# EAGLE design tarjeta-v10 (EAGLE 6.4)
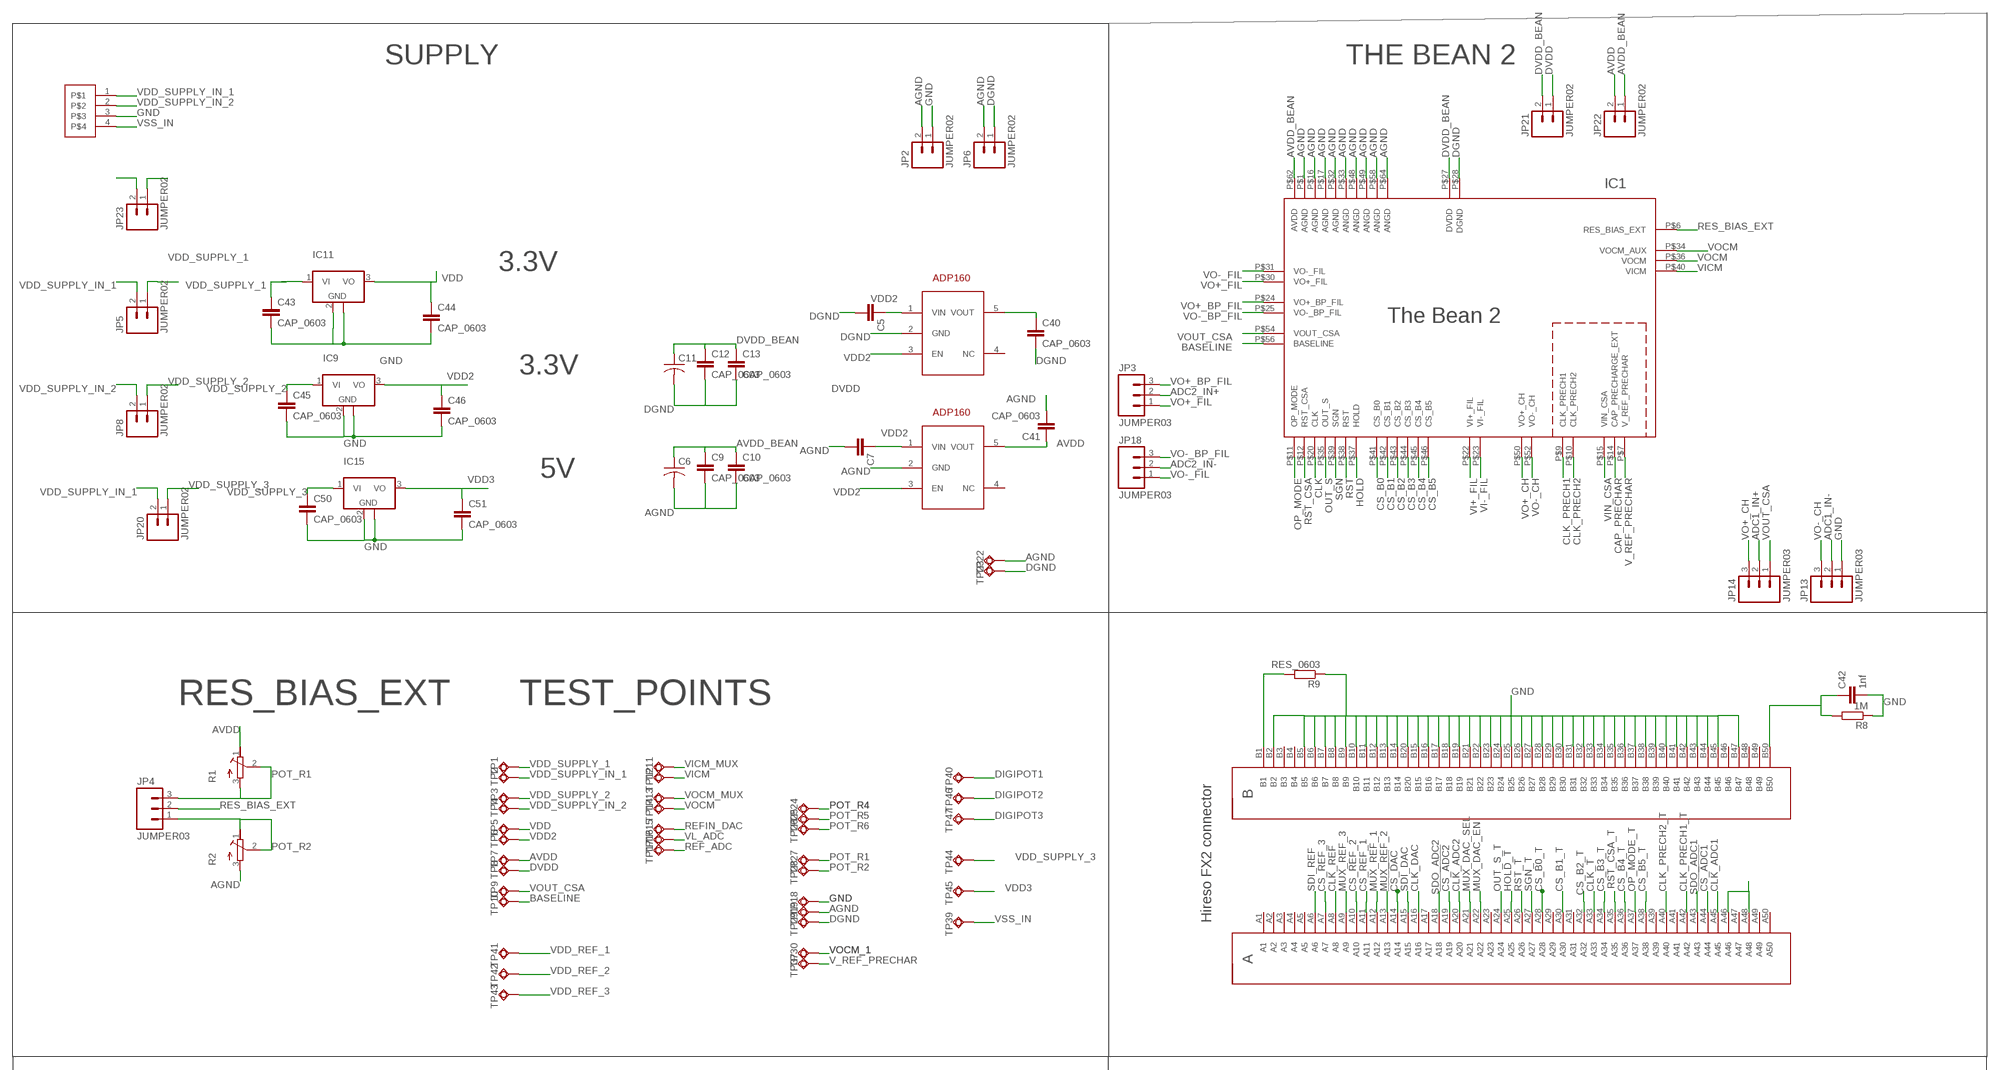
[diagram p0: schematic, sheet 1, part 1 of 3]
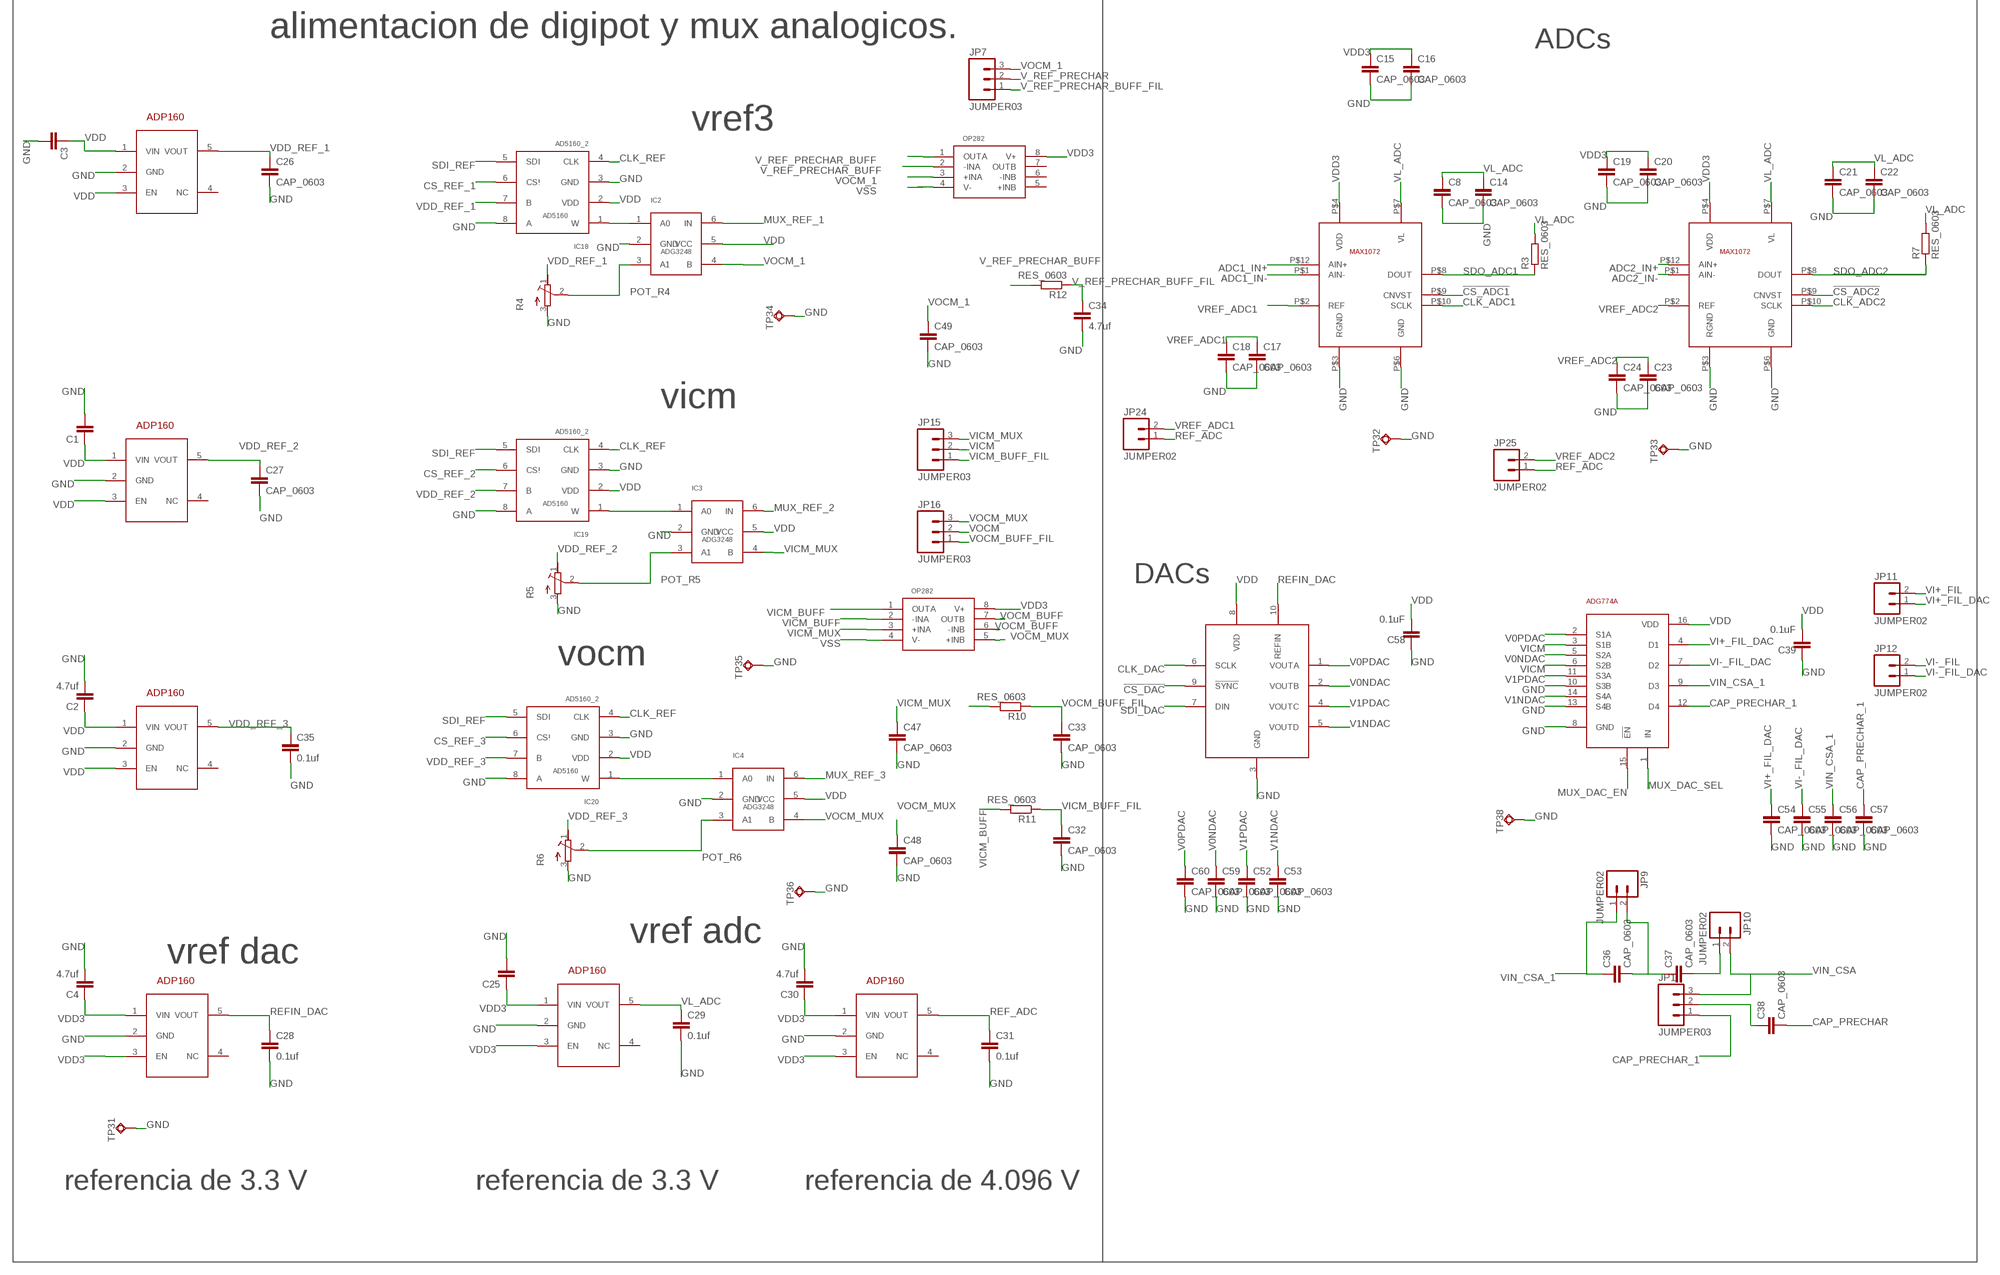
[diagram p1: schematic, sheet 1, part 2 of 3]
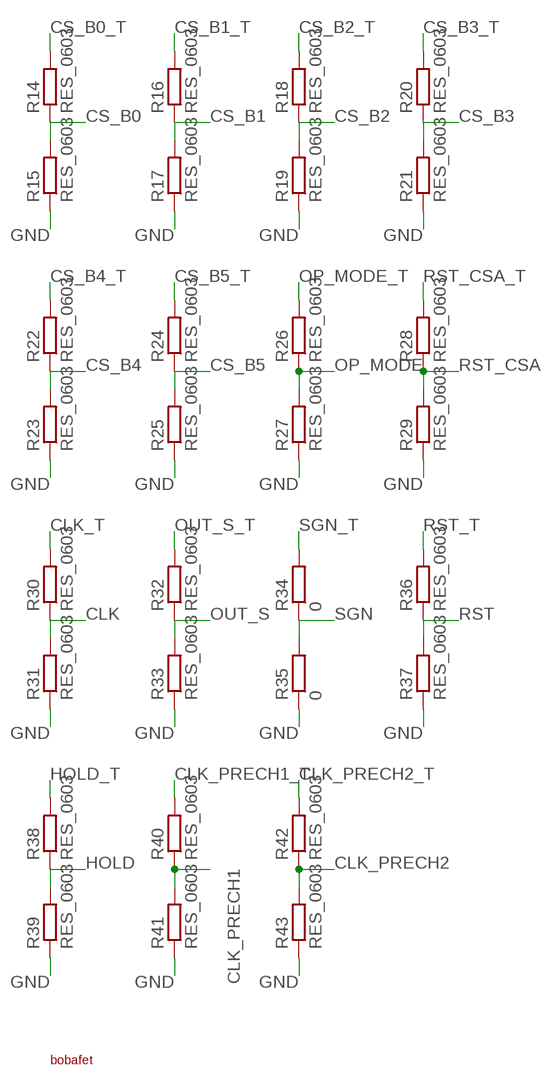
[diagram p2: schematic, sheet 1, part 3 of 3]

## Parts
C1  CAP_0402  [C0402]
C2  4.7uf  CAP_0402  [C0402]
C3  CAP_0402  [C0402]
C4  4.7uf  CAP_0402  [C0402]
C5  CAP_0402  [C0402]
C6  CAP_0805  [C0805]
C7  CAP_0402  [C0402]
C8  CAP_0603  [C0603]
C9  CAP_0603  [C0603]
C10  CAP_0603  [C0603]
C11  CAP_0805  [C0805]
C12  CAP_0603  [C0603]
C13  CAP_0603  [C0603]
C14  CAP_0603  [C0603]
C15  CAP_0603  [C0603]
C16  CAP_0603  [C0603]
C17  CAP_0603  [C0603]
C18  CAP_0603  [C0603]
C19  CAP_0603  [C0603]
C20  CAP_0603  [C0603]
C21  CAP_0603  [C0603]
C22  CAP_0603  [C0603]
C23  CAP_0603  [C0603]
C24  CAP_0603  [C0603]
C25  CAP_0402  [C0402]
C26  CAP_0603  [C0603]
C27  CAP_0603  [C0603]
C28  0.1uf  CAP_0603  [C0603]
C29  0.1uf  CAP_0603  [C0603]
C30  4.7uf  CAP_0402  [C0402]
C31  0.1uf  CAP_0603  [C0603]
C32  CAP_0603  [C0603]
C33  CAP_0603  [C0603]
C34  4.7uf  CAP_0603  [C0603]
C35  0.1uf  CAP_0603  [C0603]
C36  CAP_0603  [C0603]
C37  CAP_0603  [C0603]
C38  CAP_0603  [C0603]
C39  0.1uF  CAP_0603  [C0603]
C40  CAP_0603  [C0603]
C41  CAP_0603  [C0603]
C42  1nf  CAP_0603  [C0603]
C43  CAP_0603  [C0603]
C44  CAP_0603  [C0603]
C45  CAP_0603  [C0603]
C46  CAP_0603  [C0603]
C47  CAP_0603  [C0603]
C48  CAP_0603  [C0603]
C49  CAP_0603  [C0603]
C50  CAP_0603  [C0603]
C51  CAP_0603  [C0603]
C52  CAP_0603  [C0603]
C53  CAP_0603  [C0603]
C54  CAP_0603  [C0603]
C55  CAP_0603  [C0603]
C56  CAP_0603  [C0603]
C57  CAP_0603  [C0603]
C58  0.1uF  CAP_0603  [C0603]
C59  CAP_0603  [C0603]
C60  CAP_0603  [C0603]
IC1  THEBEAN2  [CQFP64]
IC2  ADG3248  [SC70]
IC3  ADG3248  [SC70]
IC4  ADG3248  [SC70]
IC5  ADP160  [SOT23-5L_2]
IC6  ADP160  [SOT23-5L_2]
IC7  ADP160  [SOT23-5L_2]
IC8  ADP160  [SOT23-5L_2]
IC9  UA78M  [SOT223]
IC10  ADP160  [SOT23-5L_2]
IC11  UA78M  [SOT223]
IC12  OP282  [SOIC8]
IC13  ADP160  [SOT23-5L_2]
IC14  OP282  [SOIC8]
IC15  UA78M  [SOT223]
IC16  ADP160  [SOT23-5L_2]
IC17  ADP160  [SOT23-5L_2]
IC18  AD5160_2  [SOT23-8_2]
IC19  AD5160_2  [SOT23-8_2]
IC20  AD5160_2  [SOT23-8_2]
IC21  ADG774A  [QSOP16]
IC22  MAX1072  [TQFN12]
IC23  DAC7554  [MSOP10]
IC24  MAX1072  [TQFN12]
J1  HIRESO_FX_CONNECTOR  [FX2-100S-1.27]
JP1  JUMPER03  [1X03]
JP2  JUMPER02  [1X02]
JP3  JUMPER03  [1X03]
JP4  JUMPER03  [1X03]
JP5  JUMPER02  [1X02]
JP6  JUMPER02  [1X02]
JP7  JUMPER03  [1X03]
JP8  JUMPER02  [1X02]
JP9  JUMPER02  [1X02]
JP10  JUMPER02  [1X02]
JP11  JUMPER02  [1X02]
JP12  JUMPER02  [1X02]
JP13  JUMPER03  [1X03]
JP14  JUMPER03  [1X03]
JP15  JUMPER03  [1X03]
JP16  JUMPER03  [1X03]
JP17  JUMPER04  [1X04]
JP18  JUMPER03  [1X03]
JP20  JUMPER02  [1X02]
JP21  JUMPER02  [1X02]
JP22  JUMPER02  [1X02]
JP23  JUMPER02  [1X02]
JP24  JUMPER02  [1X02]
JP25  JUMPER02  [1X02]
R1  TRIMMER_ST5  [ST-5EW]
R2  TRIMMER_ST5  [ST-5EW]
R3  RES_0603  [R0603]
R4  TRIMMER_ST5  [ST-5EW]
R5  TRIMMER_ST5  [ST-5EW]
R6  TRIMMER_ST5  [ST-5EW]
R7  RES_0603  [R0603]
R8  1M  RES_0603  [R0603]
R9  RES_0603  [R0603]
R10  RES_0603  [R0603]
R11  RES_0603  [R0603]
R12  RES_0603  [R0603]
R14  RES_0603  [R0603]
R15  RES_0603  [R0603]
R16  RES_0603  [R0603]
R17  RES_0603  [R0603]
R18  RES_0603  [R0603]
R19  RES_0603  [R0603]
R20  RES_0603  [R0603]
R21  RES_0603  [R0603]
R22  RES_0603  [R0603]
R23  RES_0603  [R0603]
R24  RES_0603  [R0603]
R25  RES_0603  [R0603]
R26  RES_0603  [R0603]
R27  RES_0603  [R0603]
R28  RES_0603  [R0603]
R29  RES_0603  [R0603]
R30  RES_0603  [R0603]
R31  RES_0603  [R0603]
R32  RES_0603  [R0603]
R33  RES_0603  [R0603]
R34  0  RES_0603  [R0603]
R35  0  RES_0603  [R0603]
R36  RES_0603  [R0603]
R37  RES_0603  [R0603]
R38  RES_0603  [R0603]
R39  RES_0603  [R0603]
R40  RES_0603  [R0603]
R41  RES_0603  [R0603]
R42  RES_0603  [R0603]
R43  RES_0603  [R0603]
TP1  TEST_POINT  [TP]
TP2  TEST_POINT  [TP]
TP3  TEST_POINT  [TP]
TP4  TEST_POINT  [TP]
TP5  TEST_POINT  [TP]
TP6  TEST_POINT  [TP]
TP7  TEST_POINT  [TP]
TP8  TEST_POINT  [TP]
TP9  TEST_POINT  [TP]
TP10  TEST_POINT  [TP]
TP11  TEST_POINT  [TP]
TP12  TEST_POINT  [TP]
TP13  TEST_POINT  [TP]
TP14  TEST_POINT  [TP]
TP15  TEST_POINT  [TP]
TP16  TEST_POINT  [TP]
TP17  TEST_POINT  [TP]
TP18  TEST_POINT  [TP]
TP19  TEST_POINT  [TP]
TP22  TEST_POINT  [TP]
TP23  TEST_POINT  [TP]
TP24  TEST_POINT  [TP]
TP25  TEST_POINT  [TP]
TP26  TEST_POINT  [TP]
TP27  TEST_POINT  [TP]
TP28  TEST_POINT  [TP]
TP29  TEST_POINT  [TP]
TP30  TEST_POINT  [TP]
TP31  TEST_POINT  [TP]
TP32  TEST_POINT  [TP]
TP33  TEST_POINT  [TP]
TP34  TEST_POINT  [TP]
TP35  TEST_POINT  [TP]
TP36  TEST_POINT  [TP]
TP37  TEST_POINT  [TP]
TP38  TEST_POINT  [TP]
TP39  TEST_POINT  [TP]
TP40  TEST_POINT  [TP]
TP41  TEST_POINT  [TP]
TP42  TEST_POINT  [TP]
TP43  TEST_POINT  [TP]
TP44  TEST_POINT  [TP]
TP45  TEST_POINT  [TP]
TP46  TEST_POINT  [TP]
TP47  TEST_POINT  [TP]
U$1  LOGO  [LOGO]

## Nets
!CS_ADC1: IC22.P$9(CNVST) J1.A44
!CS_ADC2: IC24.P$9(CNVST) J1.A19
!CS_DAC: IC23.9(!SYNC) J1.A14
ADC1_IN+: IC22.P$12(AIN+) JP14.2
ADC1_IN-: IC22.P$1(AIN-) JP13.2
ADC2_IN+: IC24.P$12(AIN+) JP3.2
ADC2_IN-: IC24.P$1(AIN-) JP18.2
AGND: C6.2 C7.2 C9.2 C10.2 C41.2 IC1.P$1(AGND) IC1.P$16(AGND) IC1.P$17(AGND) IC1.P$32(AGND) IC1.P$33(ANGD) IC1.P$48(ANGD) IC1.P$49(ANGD) IC1.P$58(ANGD) IC1.P$64(ANGD) IC13.2(GND) JP2.2 JP6.2 R2.3 TP19.TP TP22.TP
AVDD: C41.1 IC13.5(VOUT) JP22.2 R1.1 TP7.TP
AVDD_BEAN: C6.1 C9.1 C10.1 IC1.P$62(AVDD) JP22.1
BASELINE: IC1.P$56(BASELINE) TP10.TP
CAP_PRECHAR: C38.2 IC1.P$14(CAP_PRECHARGE_EXT)
CAP_PRECHAR_1: C57.1 IC21.12(D4) JP1.1
CLK: IC1.P$20(CLK) R30.1 R31.2
CLK_ADC1: IC22.P$10(SCLK) J1.A45
CLK_ADC2: IC24.P$10(SCLK) J1.A20
CLK_DAC: IC23.6(SCLK) J1.A16
CLK_PRECH1: IC1.P$9(CLK_PRECH1) R40.1 R41.2
CLK_PRECH1_T: J1.A42 R40.2
CLK_PRECH2: IC1.P$10(CLK_PRECH2) R42.1 R43.2
CLK_PRECH2_T: J1.A40 R42.2
CLK_REF: IC18.4(CLK) IC19.4(CLK) IC20.4(CLK) J1.A8
CLK_T: J1.A33 R30.2
CS_B0: IC1.P$41(CS_B0) R14.1 R15.2
CS_B0_T: J1.A28 R14.2
CS_B1: IC1.P$42(CS_B1) R16.1 R17.2
CS_B1_T: J1.A30 R16.2
CS_B2: IC1.P$43(CS_B2) R18.1 R19.2
CS_B2_T: J1.A32 R18.2
CS_B3: IC1.P$44(CS_B3) R20.1 R21.2
CS_B3_T: J1.A34 R20.2
CS_B4: IC1.P$45(CS_B4) R22.1 R23.2
CS_B4_T: J1.A36 R22.2
CS_B5: IC1.P$46(CS_B5) R24.1 R25.2
CS_B5_T: J1.A38 R24.2
CS_REF_1: IC18.6(CS!) J1.A11
CS_REF_2: IC19.6(CS!) J1.A10
CS_REF_3: IC20.6(CS!) J1.A7
DGND: C5.2 C11.2 C12.2 C13.2 C40.2 IC1.P$28(DGND) IC10.2(GND) JP6.1 TP23.TP TP29.TP
DIGIPOT1: IC2.1(A0) IC18.1(W) TP40.TP
DIGIPOT2: IC3.1(A0) IC19.1(W) TP46.TP
DIGIPOT3: IC4.1(A0) IC20.1(W) TP47.TP
DVDD: C40.1 IC10.5(VOUT) JP21.1 TP8.TP
DVDD_BEAN: C11.1 C12.1 C13.1 IC1.P$27(DVDD) JP21.2
GND: C1.2 C2.2 C3.2 C4.2 C8.2 C14.2 C15.2 C16.2 C17.2 C18.2 C19.2 C20.2 C21.2 C22.2 C23.2 C24.2 C25.2 C26.2 C27.2 C28.2 C29.2 C30.2 C31.2 C32.2 C33.2 C34.2 C35.2 C39.1 C42.2 C43.2 C44.2 C45.2 C46.2 C47.2 C48.2 C49.2 C50.2 C51.2 C52.2 C53.2 C54.2 C55.2 C56.2 C57.2 C58.1 C59.2 C60.2 IC2.2(GND) IC3.2(GND) IC4.2(GND) IC5.2(GND) IC6.2(GND) IC7.2(GND) IC8.2(GND) IC9.2(GND) IC9.4(GND) IC11.2(GND) IC11.4(GND) IC15.2(GND) IC15.4(GND) IC16.2(GND) IC17.2(GND) IC18.3(GND) IC18.8(A) IC19.3(GND) IC19.8(A) IC20.3(GND) IC20.8(A) IC21.8(GND) IC21.10(S3B) IC21.13(S4B) IC22.P$3(RGND) IC22.P$6(GND) IC23.3(GND) IC24.P$3(RGND) IC24.P$6(GND) J1.B2 J1.B5 J1.B6 J1.B7 J1.B8 J1.B9 J1.B10 J1.B11 J1.B12 J1.B13 J1.B14 J1.B15 J1.B16 J1.B17 J1.B18 J1.B19 J1.B20 J1.B21 J1.B22 J1.B23 J1.B24 J1.B25 J1.B26 J1.B27 J1.B28 J1.B29 J1.B30 J1.B31 J1.B32 J1.B33 J1.B34 J1.B35 J1.B36 J1.B37 J1.B38 J1.B39 J1.B40 J1.B41 J1.B42 J1.B43 J1.B44 J1.B45 J1.B47 JP2.1 JP13.1 JP17.3 R4.3 R5.3 R6.3 R8.1 R9.1 R15.1 R17.1 R19.1 R21.1 R23.1 R25.1 R27.1 R29.1 R31.1 R33.1 R35.1 R37.1 R39.1 R41.1 R43.1 TP18.TP TP31.TP TP32.TP TP33.TP TP34.TP TP35.TP TP36.TP TP38.TP
HOLD: IC1.P$37(HOLD) R38.1 R39.2
HOLD_T: J1.A25 R38.2
MUX_DAC_EN: IC21.15(!EN) J1.A22
MUX_DAC_SEL: IC21.1(IN) J1.A21
MUX_REF_1: IC2.6(IN) J1.A12
MUX_REF_2: IC3.6(IN) J1.A13
MUX_REF_3: IC4.6(IN) J1.A9
N$1: C36.2 C37.1 JP9.2
N$2: J1.B1 R9.2
N$3: C37.2 JP10.1
N$4: J1.A46 J1.A48
N$6: C38.1 JP1.2
N$10: C42.1 J1.B50 R8.2
OP_MODE: IC1.P$11(OP_MODE) R26.1 R27.2
OP_MODE_T: J1.A37 R26.2
OUT_S: IC1.P$35(OUT_S) R32.1 R33.2
OUT_S_T: J1.A24 R32.2
POT_R1: JP4.3 R1.2 R1.3 TP27.TP
POT_R2: JP4.1 R2.1 R2.2 TP28.TP
POT_R4: IC2.3(A1) R4.2 TP24.TP
POT_R5: IC3.3(A1) R5.2 TP25.TP
POT_R6: IC4.3(A1) R6.2 TP26.TP
REF_ADC: C31.1 IC17.5(VOUT) JP24.1 JP25.1 TP17.TP
REFIN_DAC: C28.1 IC8.5(VOUT) IC23.10(REFIN) TP15.TP
RES_BIAS_EXT: IC1.P$6(RES_BIAS_EXT) JP4.2
RST: IC1.P$38(RST) R36.1 R37.2
RST_CSA: IC1.P$12(RST_CSA) R28.1 R29.2
RST_CSA_T: J1.A35 R28.2
RST_T: J1.A26 R36.2
SDI_DAC: IC23.7(DIN) J1.A15
SDI_REF: IC18.5(SDI) IC19.5(SDI) IC20.5(SDI) J1.A6
SDO_ADC1: IC22.P$8(DOUT) J1.A43 R3.1
SDO_ADC2: IC24.P$8(DOUT) J1.A18 R7.1
SGN: IC1.P$39(SGN) R34.1 R35.2
SGN_T: J1.A27 R34.2
V0NDAC: C59.1 IC21.5(S2A) IC23.2(VOUTB)
V0PDAC: C60.1 IC21.2(S1A) IC23.1(VOUTA)
V1NDAC: C53.1 IC21.14(S4A) IC23.5(VOUTD)
V1PDAC: C52.1 IC21.11(S3A) IC23.4(VOUTC)
V_REF_PRECHAR: IC1.P$7(V_REF_PRECHAR) JP7.2 TP37.TP
V_REF_PRECHAR_BUFF: IC14.1(OUTA) IC14.2(-INA) R12.2
V_REF_PRECHAR_BUFF_FIL: C34.1 JP7.1 R12.1
VDD: C1.1 C2.1 C3.1 C39.2 C44.1 C58.2 IC2.5(VCC) IC3.5(VCC) IC4.5(VCC) IC5.1(VIN) IC5.3(EN) IC6.1(VIN) IC6.3(EN) IC7.1(VIN) IC7.3(EN) IC11.3(VO) IC18.2(VDD) IC19.2(VDD) IC20.2(VDD) IC21.16(VDD) IC23.8(VDD) TP5.TP
VDD2: C5.1 C7.1 C46.1 IC9.3(VO) IC10.1(VIN) IC10.3(EN) IC13.1(VIN) IC13.3(EN) TP6.TP
VDD3: C4.1 C15.1 C16.1 C19.1 C20.1 C25.1 C30.1 C51.1 IC8.1(VIN) IC8.3(EN) IC12.8(V+) IC14.8(V+) IC15.3(VO) IC16.1(VIN) IC16.3(EN) IC17.1(VIN) IC17.3(EN) IC22.P$4(VDD) IC24.P$4(VDD) TP45.TP
VDD_REF_1: C26.1 IC5.5(VOUT) IC18.7(B) R4.1 TP41.TP
VDD_REF_2: C27.1 IC6.5(VOUT) IC19.7(B) R5.1 TP42.TP
VDD_REF_3: C35.1 IC7.5(VOUT) IC20.7(B) R6.1 TP43.TP
VDD_SUPPLY_1: C43.1 IC11.1(VI) JP5.1 TP1.TP
VDD_SUPPLY_2: C45.1 IC9.1(VI) JP8.1 TP3.TP
VDD_SUPPLY_3: C50.1 IC15.1(VI) JP20.1 TP44.TP
VDD_SUPPLY_IN_1: JP5.2 JP17.1 JP20.2 TP2.TP
VDD_SUPPLY_IN_2: JP8.2 JP17.2 TP4.TP
VI+_FIL: IC1.P$22(VI+_FIL) JP11.2
VI+_FIL_DAC: C54.1 IC21.4(D1) JP11.1
VI-_FIL: IC1.P$23(VI-_FIL) JP12.2
VI-_FIL_DAC: C55.1 IC21.7(D2) JP12.1
VICM: IC1.P$40(VICM) IC21.3(S1B) IC21.6(S2B) JP15.2 TP12.TP
VICM_BUFF: IC12.1(OUTA) IC12.2(-INA) R11.2
VICM_BUFF_FIL: C32.1 JP15.1 R11.1
VICM_MUX: C47.1 IC3.4(B) IC12.3(+INA) JP15.3 TP11.TP
VIN_CSA: IC1.P$15(VIN_CSA) JP1.3 JP10.2
VIN_CSA_1: C36.1 C56.1 IC21.9(D3) JP9.1
VL_ADC: C8.1 C14.1 C21.1 C22.1 C29.1 IC16.5(VOUT) IC22.P$7(VL) IC24.P$7(VL) R3.2 R7.2 TP16.TP
VO+_BP_FIL: IC1.P$24(VO+_BP_FIL) JP3.3
VO+_CH: IC1.P$50(VO+_CH) JP14.3
VO+_FIL: IC1.P$30(VO+_FIL) JP3.1
VO-_BP_FIL: IC1.P$25(VO-_BP_FIL) JP18.3
VO-_CH: IC1.P$52(VO-_CH) JP13.3
VO-_FIL: IC1.P$31(VO-_FIL) JP18.1
VOCM: IC1.P$34(VOCM_AUX) IC1.P$36(VOCM) JP16.2 TP14.TP
VOCM_1: C49.1 IC2.4(B) IC14.3(+INA) JP7.3 TP30.TP
VOCM_BUFF: IC12.6(-INB) IC12.7(OUTB) R10.2
VOCM_BUFF_FIL: C33.1 JP16.1 R10.1
VOCM_MUX: C48.1 IC4.4(B) IC12.5(+INB) JP16.3 TP13.TP
VOUT_CSA: IC1.P$54(VOUT_CSA) JP14.1 TP9.TP
VREF_ADC1: C17.1 C18.1 IC22.P$2(REF) JP24.2
VREF_ADC2: C23.1 C24.1 IC24.P$2(REF) JP25.2
VSS: IC12.4(V-) IC14.4(V-) JP23.1
VSS_IN: JP17.4 JP23.2 TP39.TP
Unconnected: IC5.4(NC) IC6.4(NC) IC7.4(NC) IC8.4(NC) IC10.4(NC) IC13.4(NC) IC14.5(+INB) IC14.6(-INB) IC14.7(OUTB) IC16.4(NC) IC17.4(NC) J1.A1 J1.A2 J1.A3 J1.A4 J1.A5 J1.A17 J1.A23 J1.A29 J1.A31 J1.A39 J1.A41 J1.A47 J1.A49 J1.A50 J1.B3 J1.B4 J1.B46 J1.B48 J1.B49

## Notes on the sheet
- SUPPLY | THE BEAN 2
- 3.3V
- 3.3V
- 5V
- RES_BIAS_EXT | TEST_POINTS
- alimentacion de digipot y mux analogicos.
- ADCs
- vref3
- vicm
- DACs
- vocm
- vref adc
- vref dac
- referencia de 3.3 V | referencia de 3.3 V | referencia de 4.096 V

## Library data of the parts
C1-C5 C7 C25 C30 = wac:CAP_0402
C6 C11 = wac:CAP_0805
C8-C10 C12-C24 C26-C29 C31-C60 = wac:CAP_0603
IC1 = wac:THEBEAN2: Nuvo modelo del chip, mantiene las mismas conexiones pero se cambio el package CQFP64
IC2-IC4 = wac:ADG3248
IC5-IC8 IC10 IC13 IC16 IC17 = wac:ADP160: Regulador Lineal de Voltaje. Generico. usa el package TSOT23-5
IC9 IC11 IC15 = wac:UA78M
IC12 IC14 = wac:OP282: OP282. Package:8-lead MSOP. Obtenido desde http://www.analog.com/media/en/technical-documentation/data-sheets/OP282_482.pdf
IC18-IC20 = wac:AD5160_2
IC21 = wac:ADG774A: Low voltage,400MHz, Quad 2:1 MUX with 3ns Switching Time http://www.analog.com/static/imported-files/data_sheets/ADG774A.pdf
IC22 IC24 = wac:MAX1072
IC23 = wac:DAC7554: 12-BIT, QUAD, ULTRALOW GLITCH, VOLTAGE OUTPUT DIGITAL-TO-ANALOG CONVERTER http://www.ti.com/lit/ds/symlink/dac7554.pdf
J1 = wac:HIRESO_FX_CONNECTOR: Conector Hireso de la serie FX2. Part Number: FX2-100S-1.27DS(L)
JP1 JP3 JP4 JP7 JP13-JP16 JP18 = wac:JUMPER03
JP2 JP5 JP6 JP8-JP12 JP20-JP25 = wac:JUMPER02
JP17 = wac:JUMPER04
R1 R2 R4-R6 = wac:TRIMMER_ST5
R3 R7-R12 R14-R43 = wac:RES_0603
TP1-TP19 TP22-TP47 = wac:TEST_POINT
U$1 = wac:LOGO

## Board
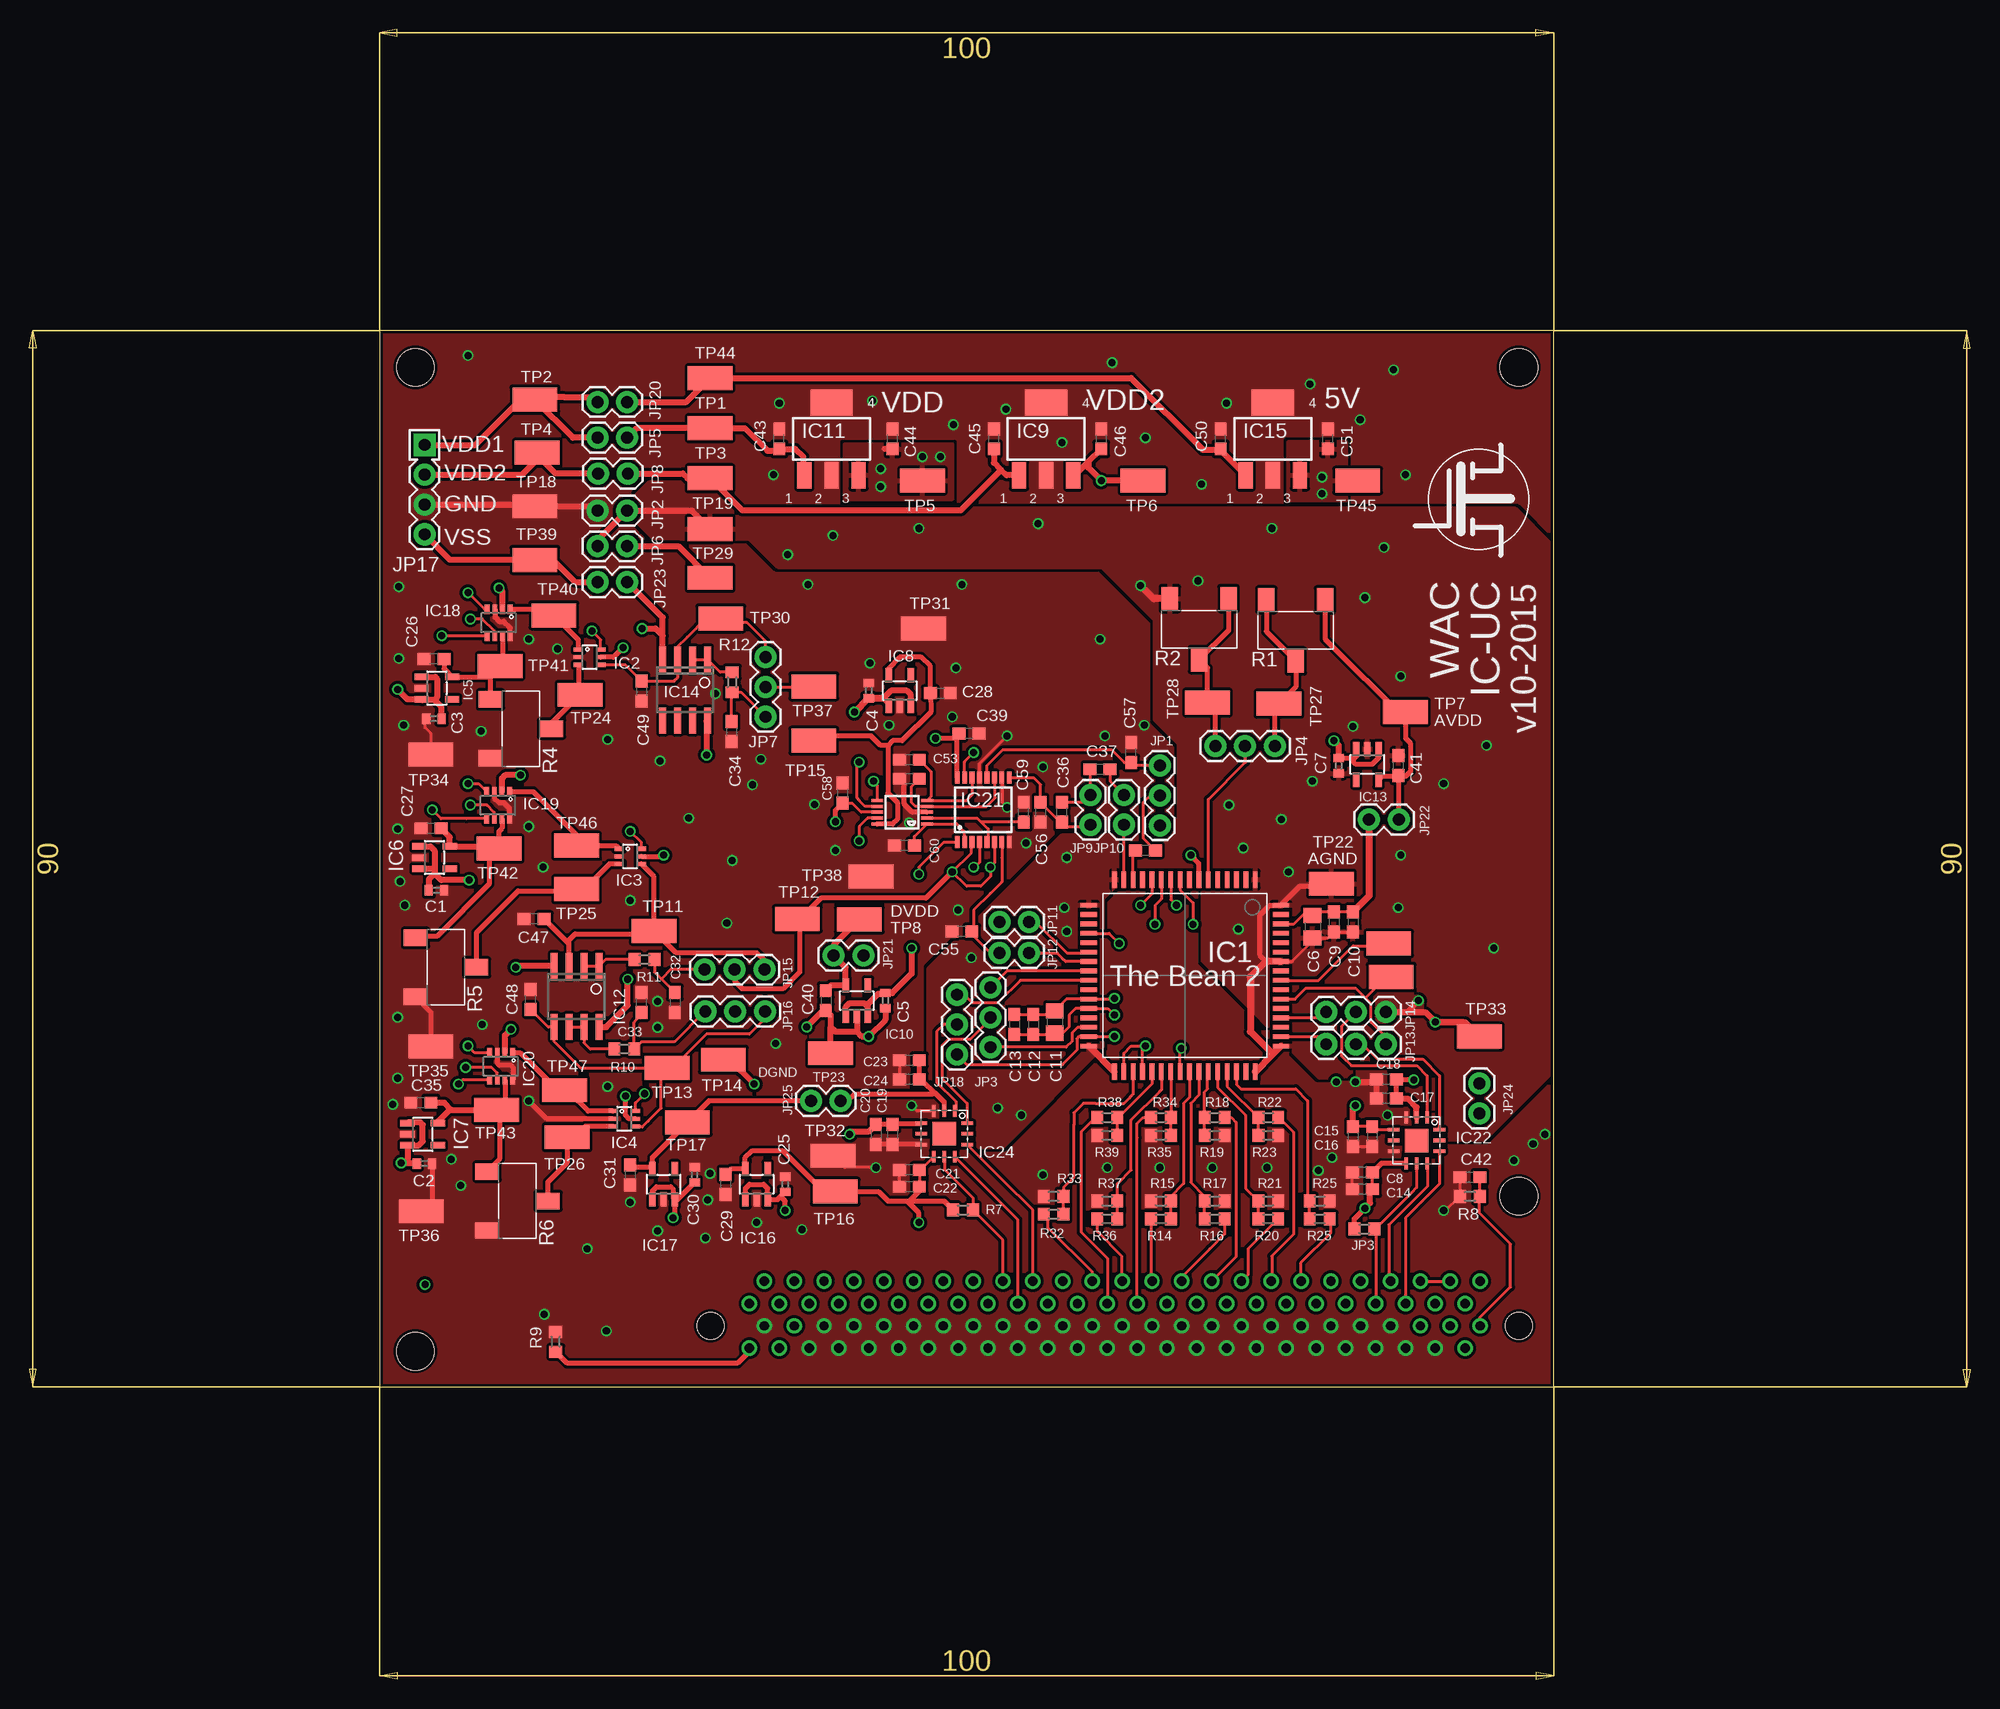
[diagram p3: board, top side]
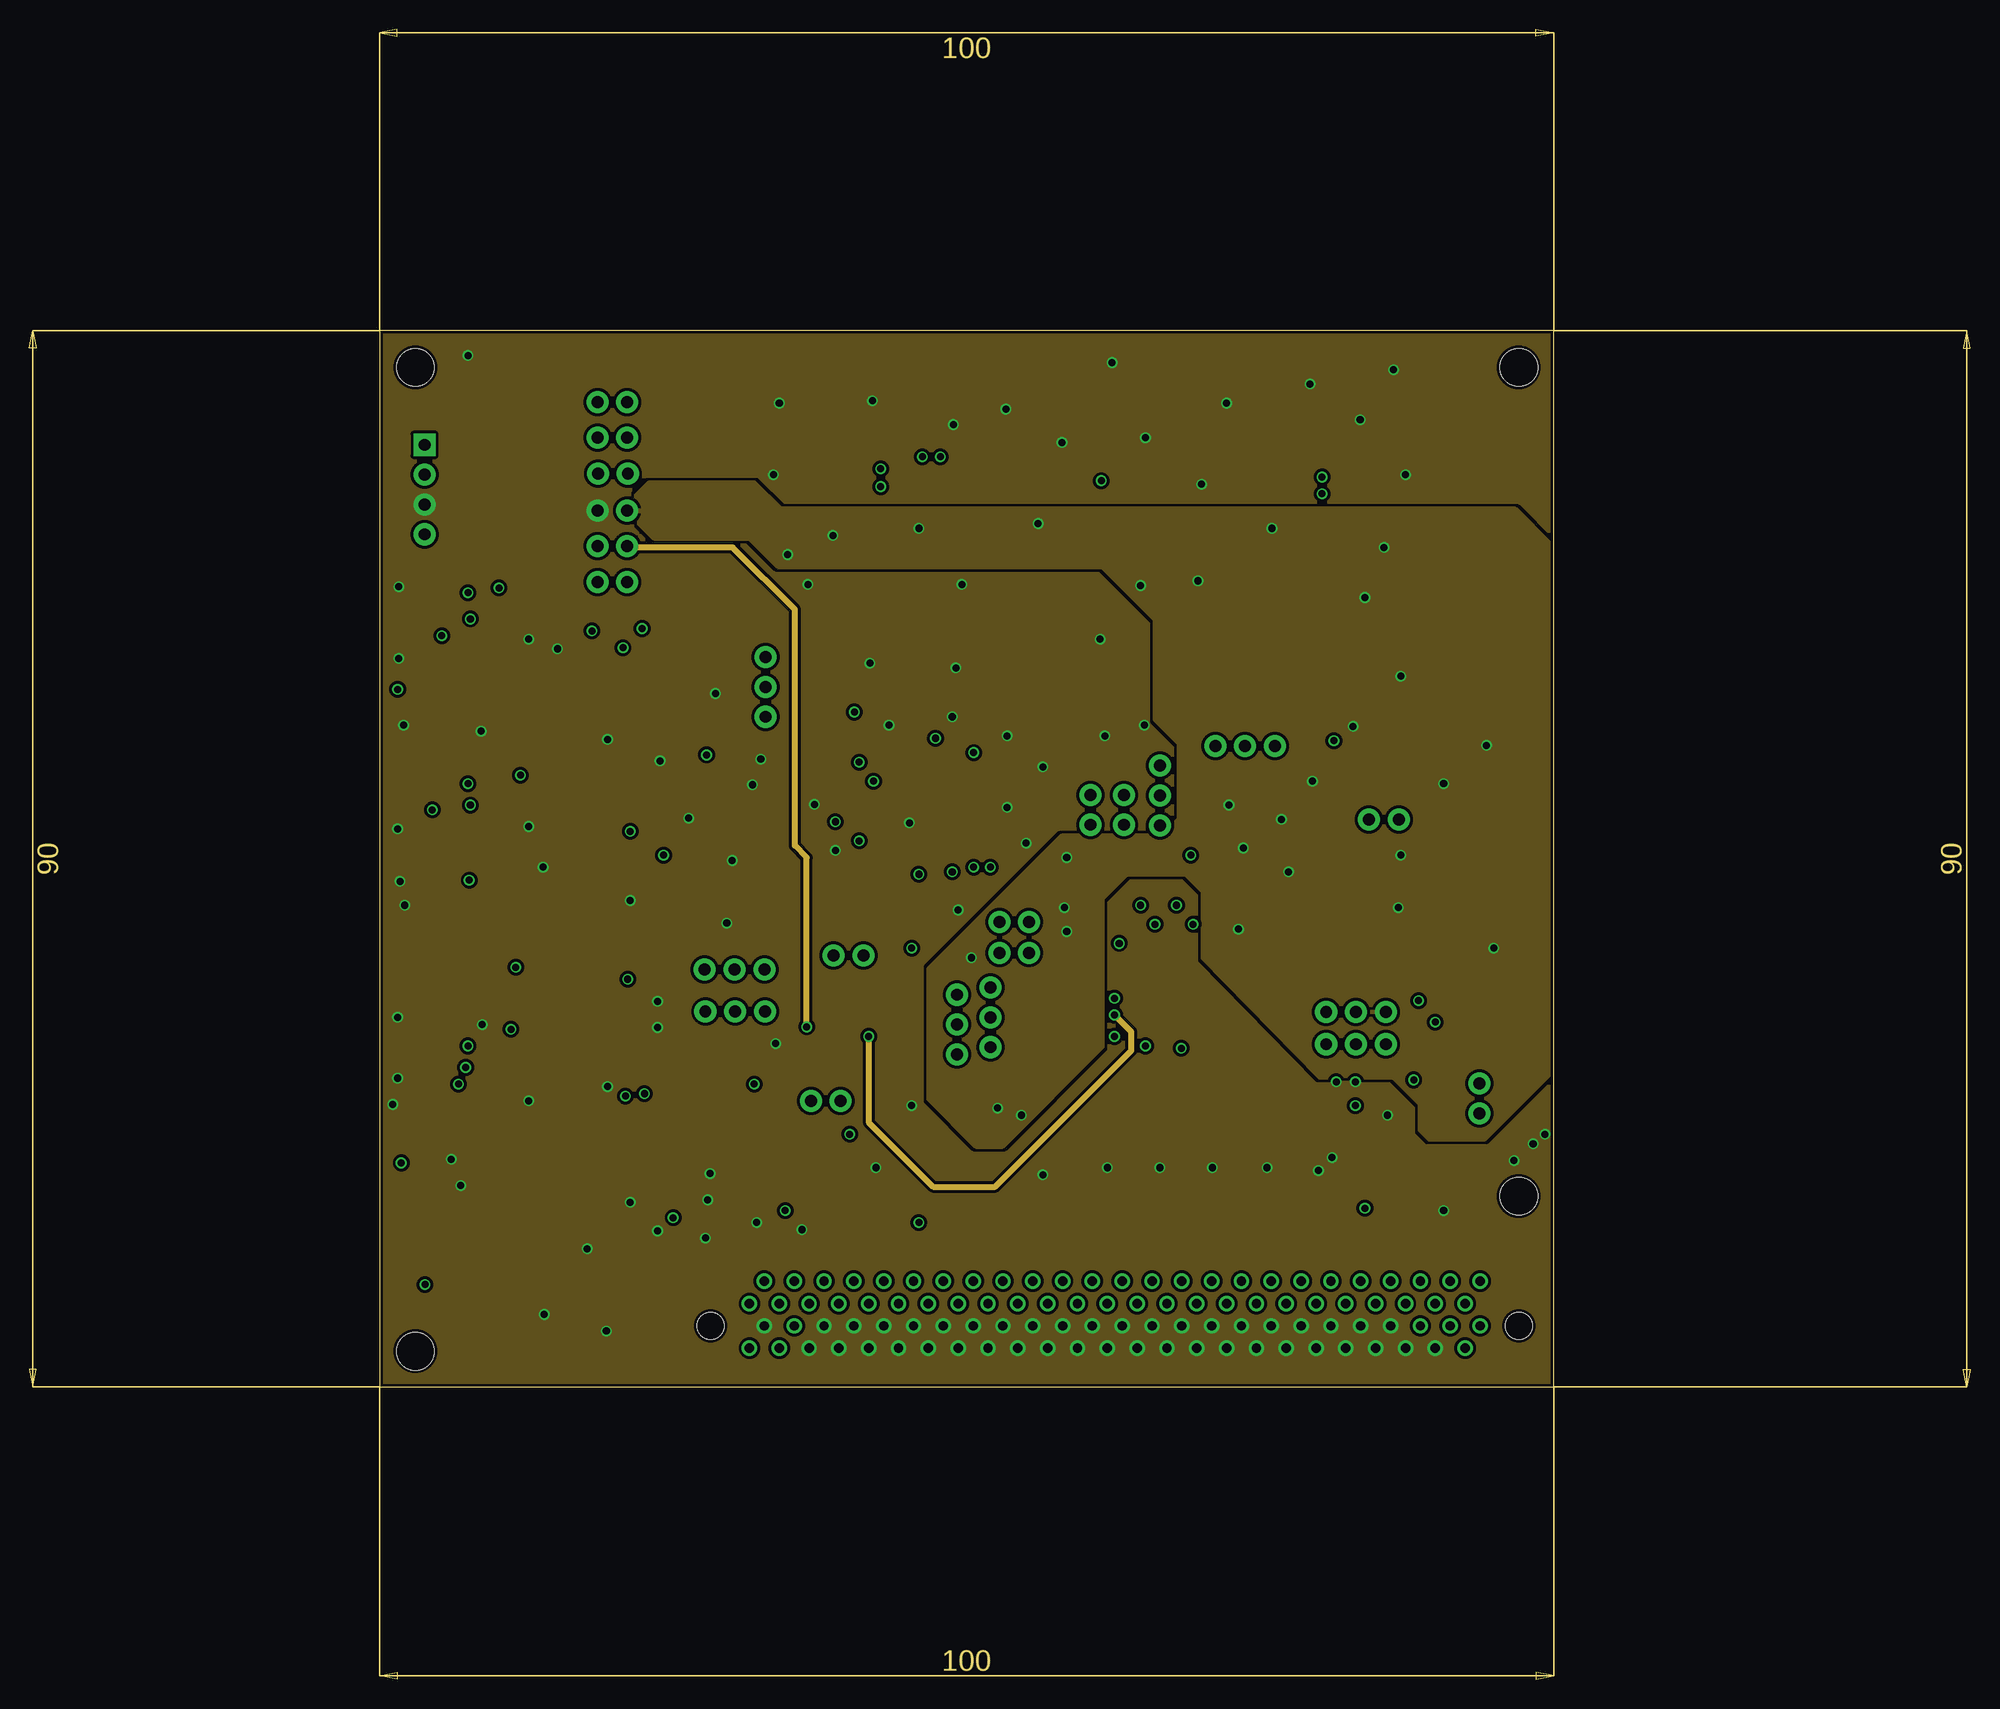
[diagram p4: board, inner layer Route2]
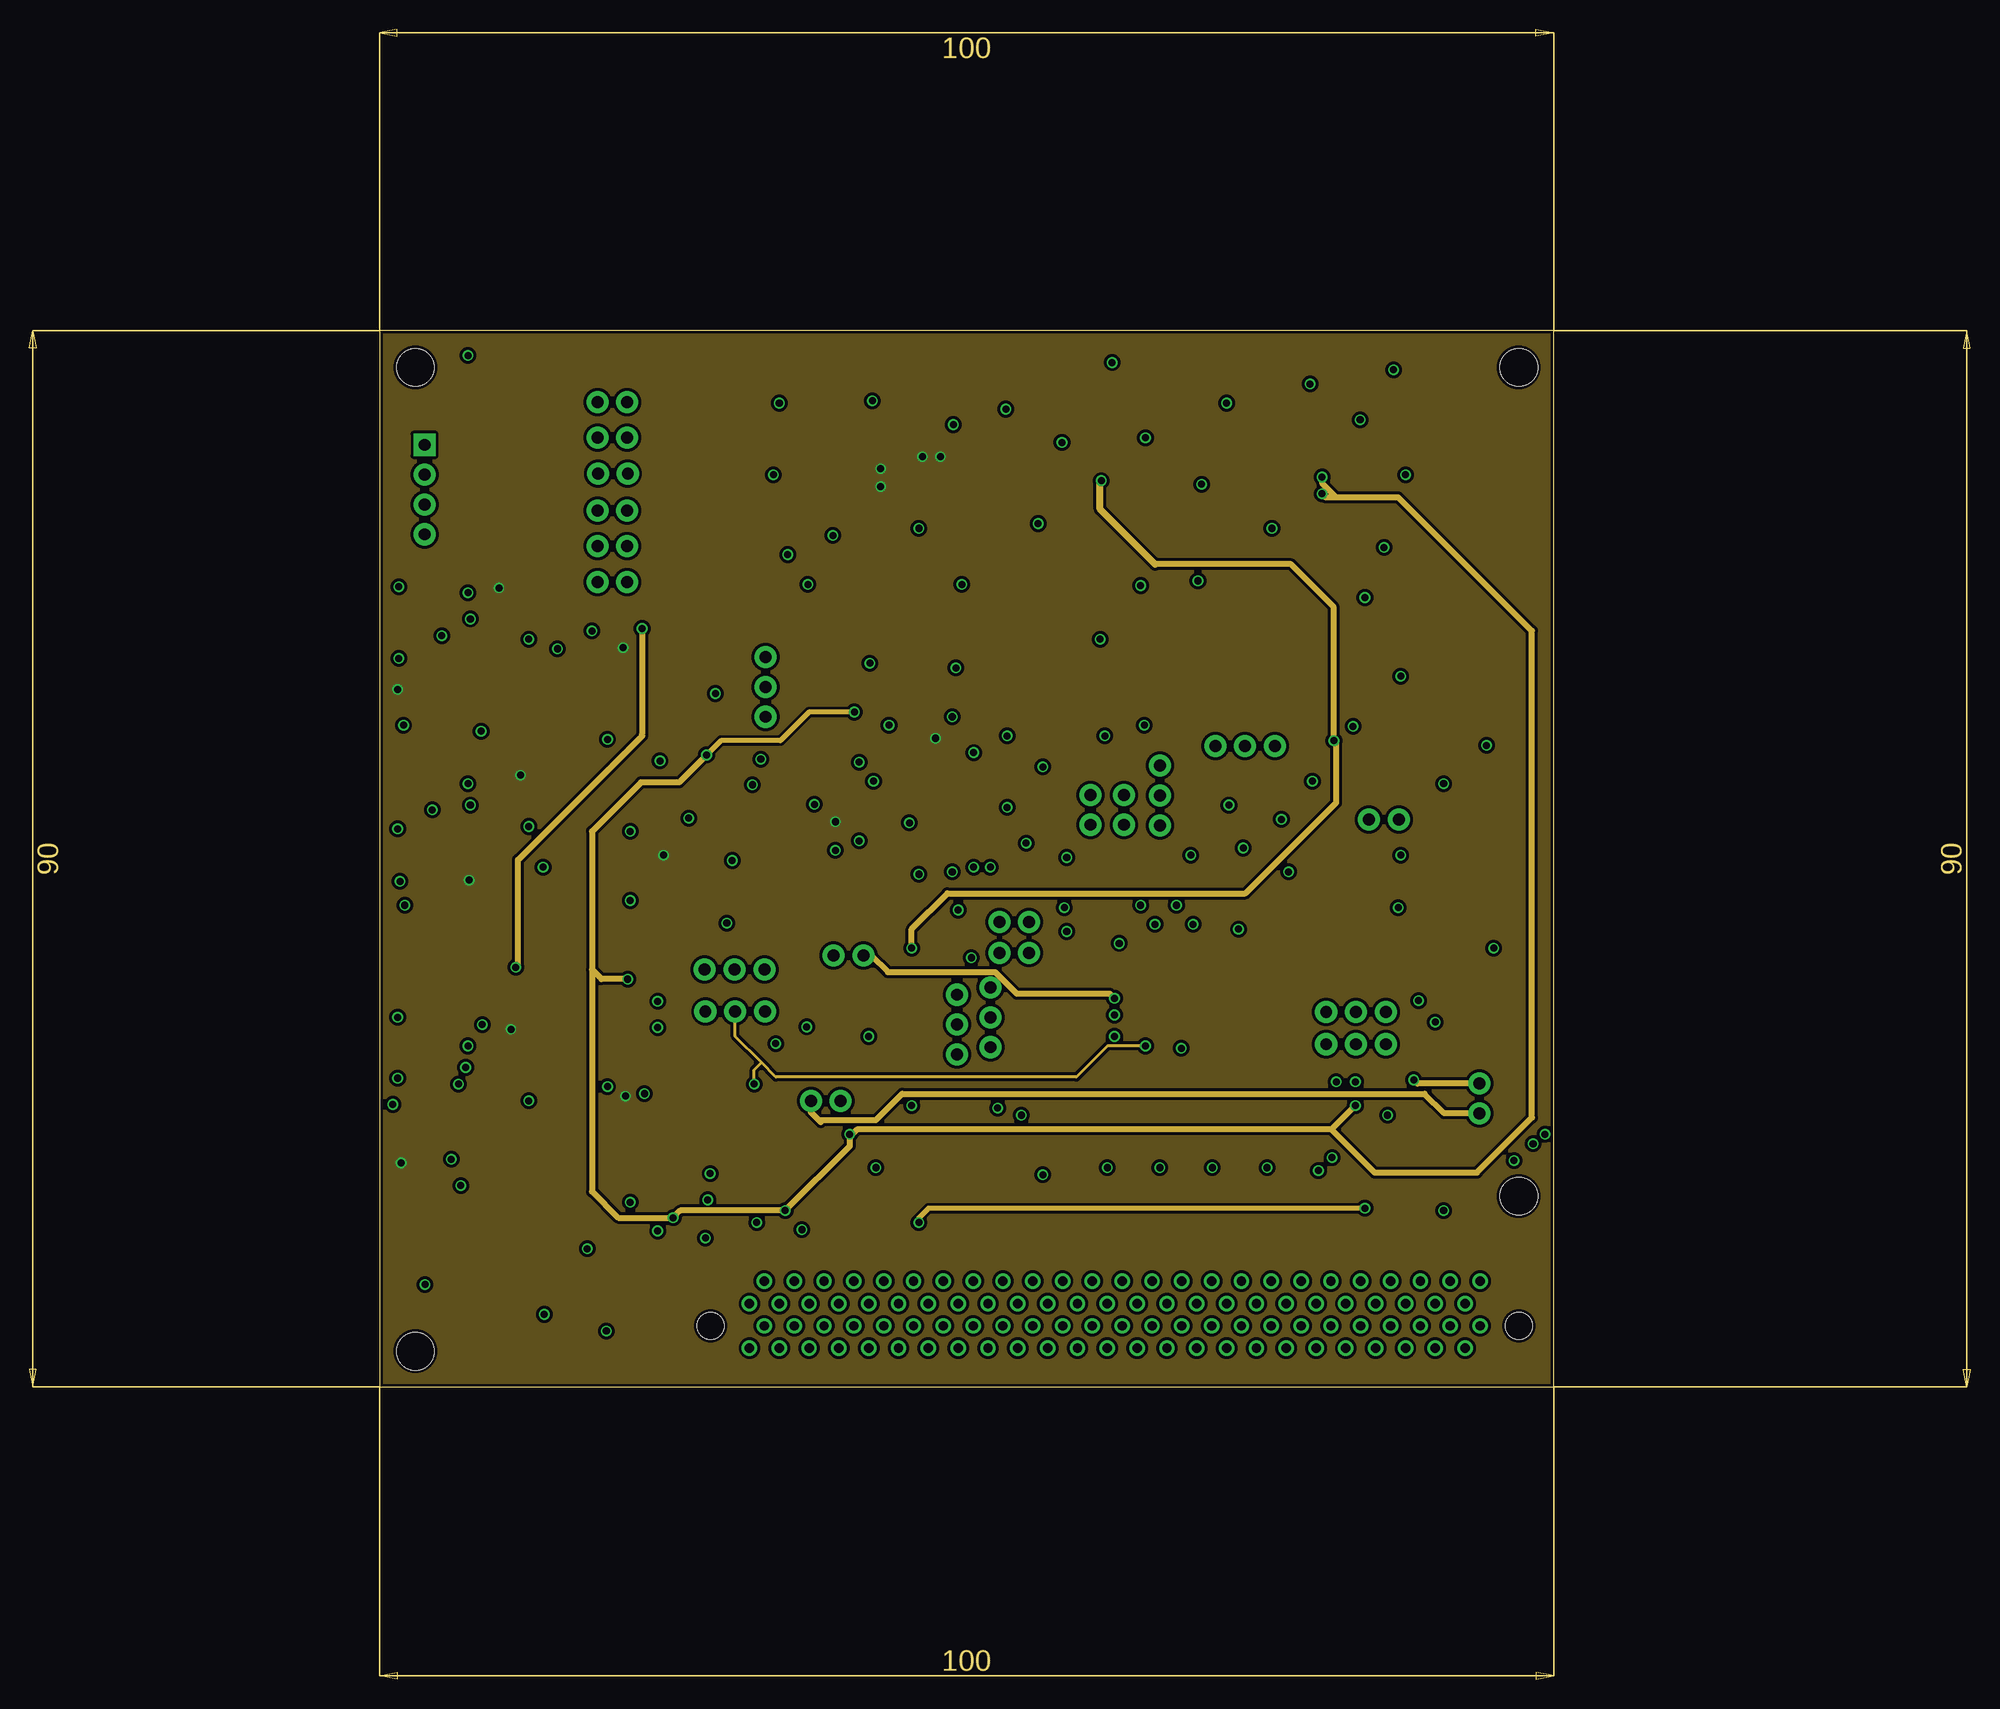
[diagram p5: board, inner layer Route3]
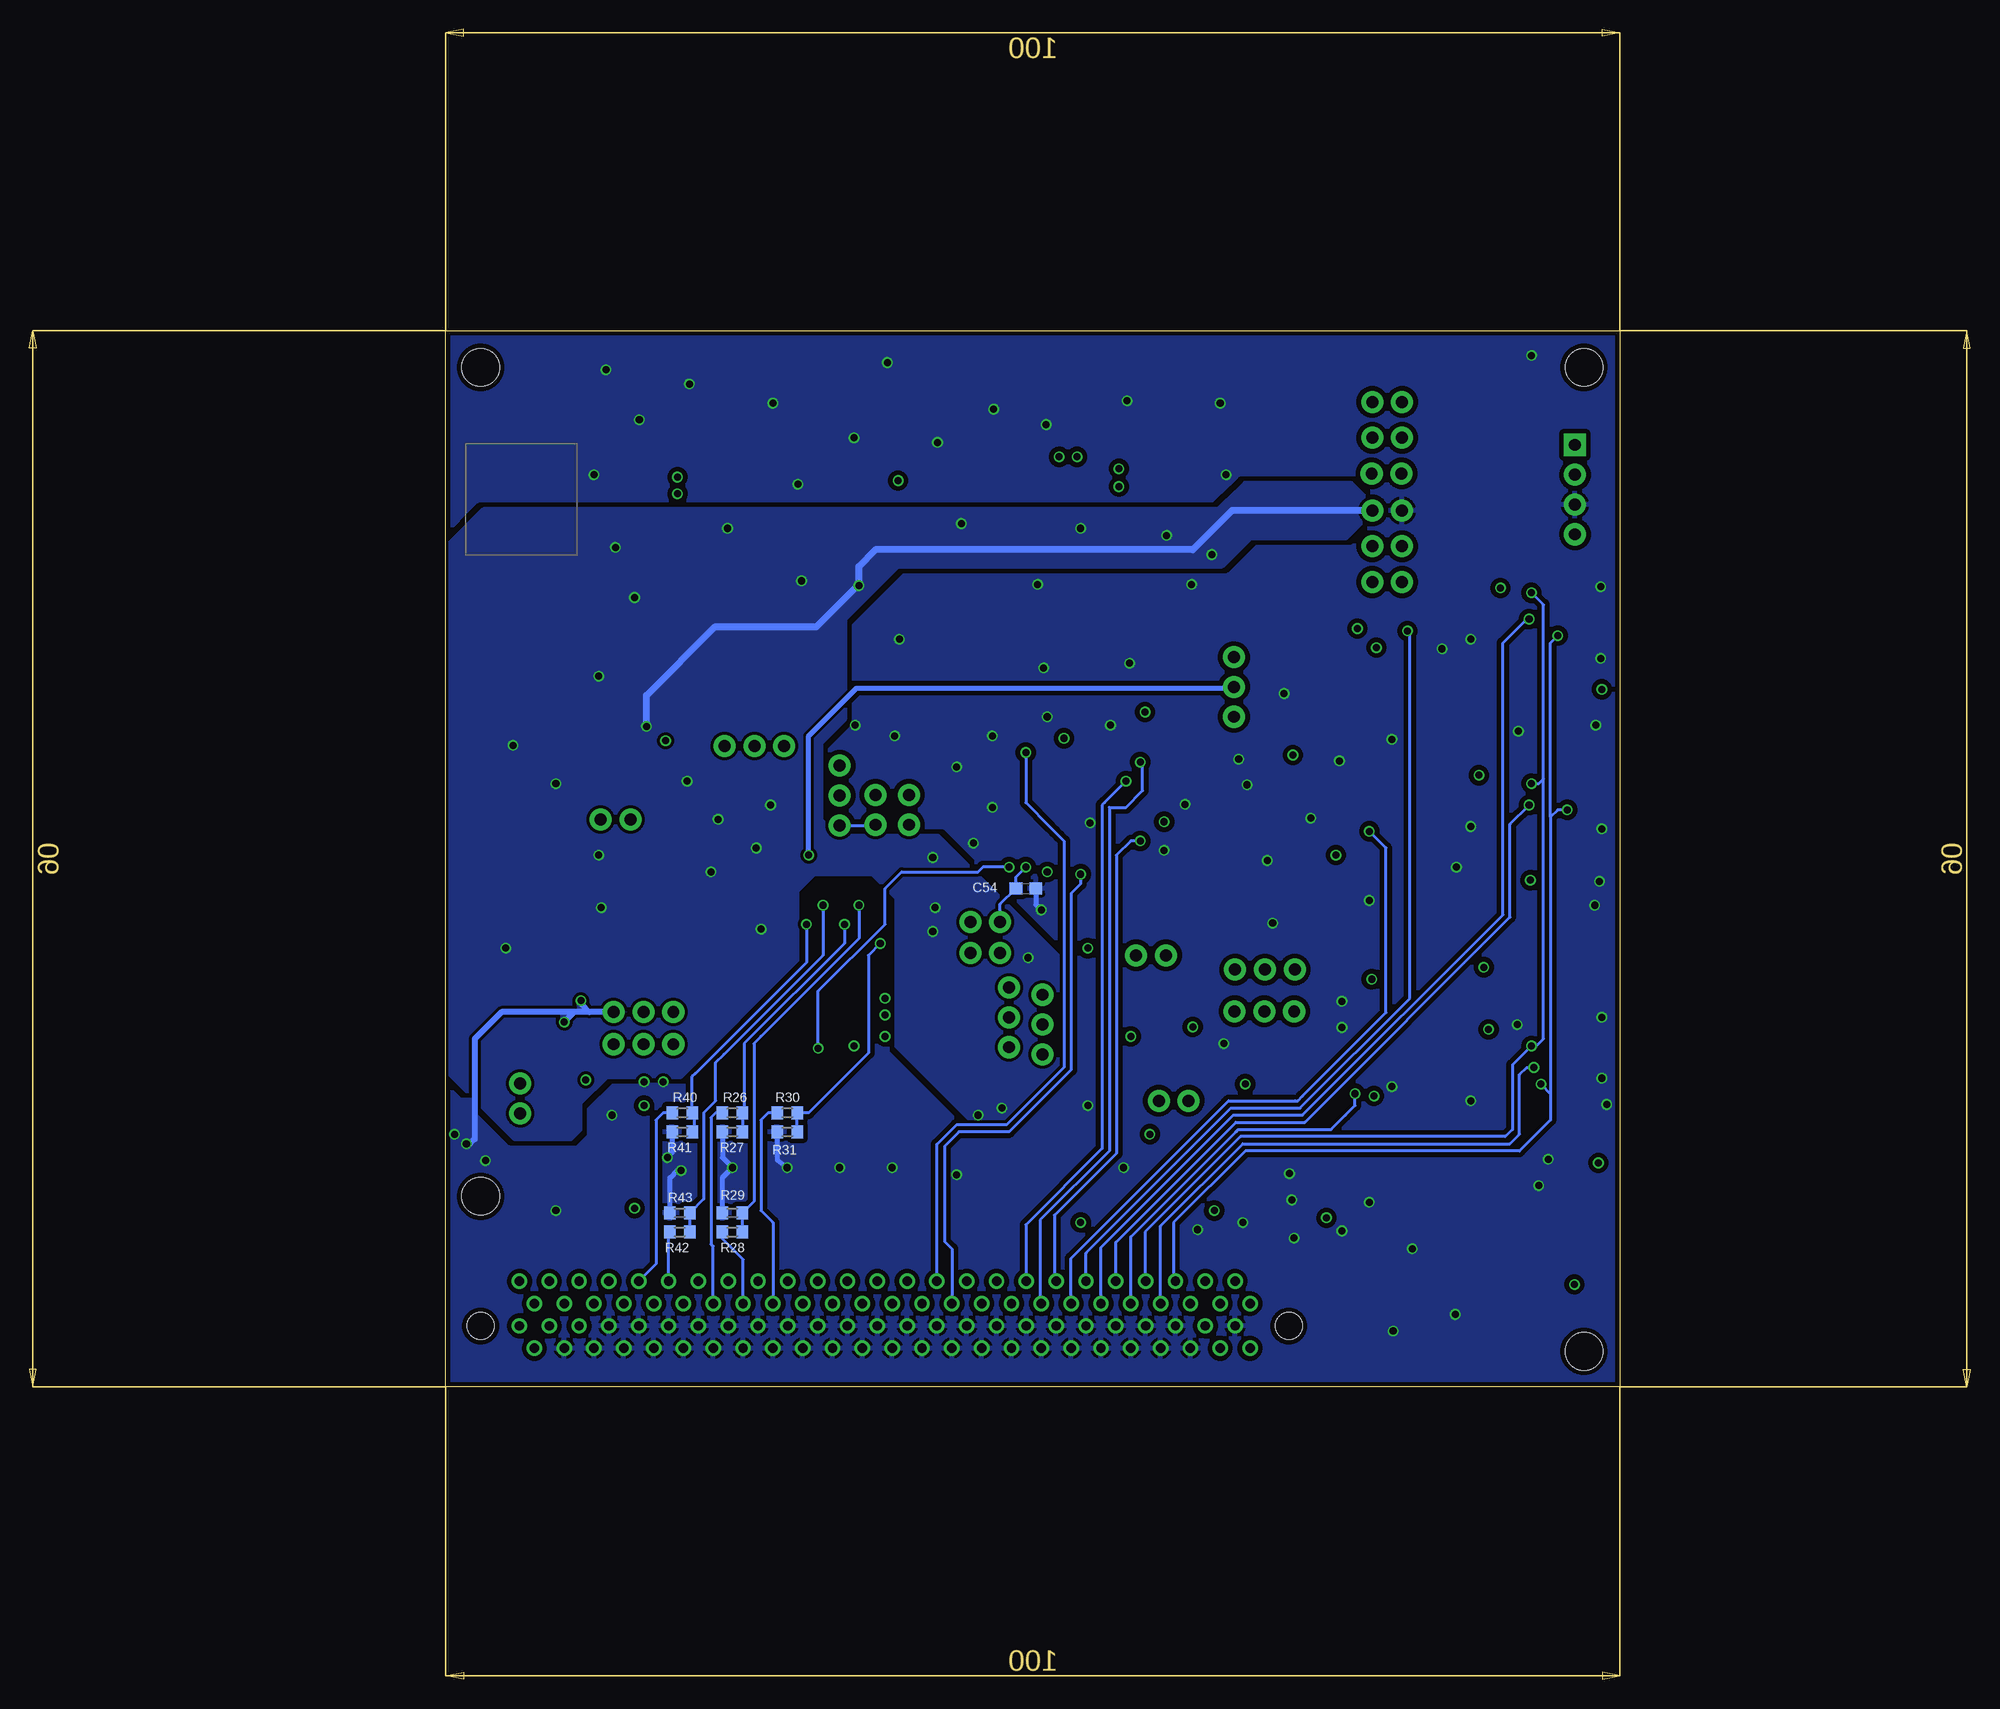
[diagram p6: board, bottom side, seen from below]

Size 100 x 90 mm. Coordinates in mm from the lower left corner, seen from the top.
Outline: 0,0 100,0 100,90 0,90 0,0
Copper layers [2:(1*2*3*16):3]: Top 0.035mm / dielectric 1.5mm / Route2 0.035mm / dielectric 0.15mm / Route3 0.035mm / dielectric 0.2mm / Bottom 0.035mm
Design rules "ITEADstudio_DRC": minimum track width 6mil, minimum drill 12mil, track to track 6mil, track to pad 6mil, pad to pad 6mil, via to via 6mil, smd to smd 0mil, copper to edge 10mil, drill to drill 10mil, minimum pad ring 10mil, minimum via ring 6mil, stop-mask expansion 2mil, vias tented up to drill 100mil, thermal gap 10mil
Holes 3.2 mm at 3.05,3.05 3.05,86.87 97.03,86.87 97.03,16.26

### Footprints (pad centres in the part's own frame; a part is rotated, then mirrored left to right if it is on the bottom)
C0402 = smd 0.7 x 0.9: 1 -0.65,0; 2 0.65,0
C0805 = smd 1.3 x 1.5: 1 -0.95,0; 2 0.95,0
C0603 = smd 1.1 x 1: 1 -0.85,0; 2 0.85,0
CQFP64 = smd 0.4 x 1.4: P$1 -6,-8.185; P$2 -5.2,-8.185; P$3 -4.4,-8.185; P$4 -3.6,-8.185; P$5 -2.8,-8.185; P$6 -2,-8.185; P$7 -1.2,-8.185; P$8 -0.4,-8.185; P$9 0.4,-8.185; P$10 1.2,-8.185; P$11 2,-8.185; P$12 2.8,-8.185; P$13 3.6,-8.185; P$14 4.4,-8.185; P$15 5.2,-8.185; P$16 6,-8.185; P$33 6,8.185; P$34 5.2,8.185; P$35 4.4,8.185; P$36 3.6,8.185; P$37 2.8,8.185; P$38 2,8.185; P$39 1.2,8.185; P$40 0.4,8.185; P$41 -0.4,8.185; P$42 -1.2,8.185; P$43 -2,8.185; P$44 -2.8,8.185; P$45 -3.6,8.185; P$46 -4.4,8.185; P$47 -5.2,8.185; P$48 -6,8.185 | smd 1.4 x 0.4: P$17 8.185,-6; P$18 8.185,-5.2; P$19 8.185,-4.4; P$20 8.185,-3.6; P$21 8.185,-2.8; P$22 8.185,-2; P$23 8.185,-1.2; P$24 8.185,-0.4; P$25 8.185,0.4; P$26 8.185,1.2; P$27 8.185,2; P$28 8.185,2.8; P$29 8.185,3.6; P$30 8.185,4.4; P$31 8.185,5.2; P$32 8.185,6; P$49 -8.185,6; P$50 -8.185,5.2; P$51 -8.185,4.4; P$52 -8.185,3.6; P$53 -8.185,2.8; P$54 -8.185,2; P$55 -8.185,1.2; P$56 -8.185,0.4; P$57 -8.185,-0.4; P$58 -8.185,-1.2; P$59 -8.185,-2; P$60 -8.185,-2.8; P$61 -8.185,-3.6; P$62 -8.185,-4.4; P$63 -8.185,-5.2; P$64 -8.185,-6
SC70 = smd 0.35 x 0.8: 1 -0.65,-0.95; 2 0,-0.95; 3 0.65,-0.95; 4 0.65,0.95; 5 0,0.95; 6 -0.65,0.95
SOT23-5L_2 = smd 0.55 x 1.2: 1 -0.95,-1.3; 2 0,-1.3; 3 0.95,-1.3; 4 0.95,1.3; 5 -0.95,1.3
SOT223 = smd 1.219 x 2.235: 1 -2.438,-3.099; 2 -0.127,-3.099; 3 2.184,-3.099 | smd 3.6 x 2.2: 4 -0.127,3.099
SOIC8 = smd 0.6 x 2.2: 1 -1.905,-2.6; 2 -0.635,-2.6; 3 0.635,-2.6; 4 1.905,-2.6; 5 1.905,2.6; 6 0.635,2.6; 7 -0.635,2.6; 8 -1.905,2.6
SOT23-8_2 = smd 0.406 x 0.813: 1 -1,-1.04; 2 -0.35,-1.04; 3 0.3,-1.04; 4 0.95,-1.04; 5 0.95,1.26; 6 0.3,1.26; 7 -0.35,1.26; 8 -1,1.26
QSOP16 = smd 0.4 x 1: 1 -2.223,-2.75; 2 -1.588,-2.75; 3 -0.953,-2.75; 4 -0.318,-2.75; 5 0.318,-2.75; 6 0.953,-2.75; 7 1.588,-2.75; 8 2.223,-2.75; 9 2.223,2.75; 10 1.588,2.75; 11 0.953,2.75; 12 0.318,2.75; 13 -0.318,2.75; 14 -0.953,2.75; 15 -1.588,2.75; 16 -2.223,2.75
TQFN12 = smd 1 x 0.3: P$1 0.05,-1.1; P$2 0.05,-2; P$3 0.05,-2.9; P$7 3.95,-2.9; P$8 3.95,-2; P$9 3.95,-1.1 | smd 0.3 x 1: P$4 1.1,-3.95; P$5 2,-3.95; P$6 2.9,-3.95; P$10 2.9,-0.05; P$11 2,-0.05; P$12 1.1,-0.05 | smd 2 x 2: P$13 2,-2
MSOP10 = smd 0.25 x 1: 1 -1,-2.113; 2 -0.5,-2.113; 3 0,-2.113; 4 0.5,-2.113; 5 1,-2.113; 6 1,2.113; 7 0.5,2.113; 8 0,2.113; 9 -0.5,2.113; 10 -1,2.113
FX2-100S-1.27 = drill 0.8: A1 0,0; A2 -1.27,-1.905; A3 -2.54,0; A4 -3.81,-1.905; A5 -5.08,0; A6 -6.35,-1.905; A7 -7.62,0; A8 -8.89,-1.905; A9 -10.16,0; A10 -11.43,-1.905; A11 -12.7,0; A12 -13.97,-1.905; A13 -15.24,0; A14 -16.51,-1.905; A15 -17.78,0; A16 -19.05,-1.905; A17 -20.32,0; A18 -21.59,-1.905; A19 -22.86,0; A20 -24.13,-1.905; A21 -25.4,0; A22 -26.67,-1.905; A23 -27.94,0; A24 -29.21,-1.905; A25 -30.48,0; A26 -31.75,-1.905; A27 -33.02,0; A28 -34.29,-1.905; A29 -35.56,0; A30 -36.83,-1.905; A31 -38.1,0; A32 -39.37,-1.905; A33 -40.64,0; A34 -41.91,-1.905; A35 -43.18,0; A36 -44.45,-1.905; A37 -45.72,0; A38 -46.99,-1.905; A39 -48.26,0; A40 -49.53,-1.905; A41 -50.8,0; A42 -52.07,-1.905; A43 -53.34,0; A44 -54.61,-1.905; A45 -55.88,0; A46 -57.15,-1.905; A47 -58.42,0; A48 -59.69,-1.905; A49 -60.96,0; A50 -62.23,-1.905; B1 0,3.8; B2 -1.27,1.895; B3 -2.54,3.8; B4 -3.81,1.895; B5 -5.08,3.8; B6 -6.35,1.895; B7 -7.62,3.8; B8 -8.89,1.895; B9 -10.16,3.8; B10 -11.43,1.895; B11 -12.7,3.8; B12 -13.97,1.895; B13 -15.24,3.8; B14 -16.51,1.895; B15 -17.78,3.8; B16 -19.05,1.895; B17 -20.32,3.8; B18 -21.59,1.895; B19 -22.86,3.8; B20 -24.13,1.895; B21 -25.4,3.8; B22 -26.67,1.895; B23 -27.94,3.8; B24 -29.21,1.895; B25 -30.48,3.8; B26 -31.75,1.895; B27 -33.02,3.8; B28 -34.29,1.895; B29 -35.56,3.8; B30 -36.83,1.895; B31 -38.1,3.8; B32 -39.37,1.895; B33 -40.64,3.8; B34 -41.91,1.895; B35 -43.18,3.8; B36 -44.45,1.895; B37 -45.72,3.8; B38 -46.99,1.895; B39 -48.26,3.8; B40 -49.53,1.895; B41 -50.8,3.8; B42 -52.07,1.895; B43 -53.34,3.8; B44 -54.61,1.895; B45 -55.88,3.8; B46 -57.15,1.895; B47 -58.42,3.8; B48 -59.69,1.895; B49 -60.96,3.8; B50 -62.23,1.895 | hole 2.3: -65.54,1.905; 3.31,1.905
1X03 = drill 1.016 pad 1.88: 1 -2.54,0; 2 0,0; 3 2.54,0
1X02 = drill 1.016 pad 1.88: 1 -1.27,0; 2 1.27,0
1X04 = drill 1.016 pad 1.88 square: 1 0,0 | drill 1.016 pad 1.88: 2 2.54,0; 3 5.08,0; 4 7.62,0
ST-5EW = smd 1.4 x 2: 1 -2.5,-2.6; 2 0,2.6; 3 2.5,-2.6
R0603 = smd 1 x 1.1: 1 -0.85,0; 2 0.85,0
TP = smd 3.81 x 2.032: TP 0,0

### Placement (x,y rotation side)
C1  4.83,42.32 0 top
C2  3.81,19.05 0 top
C3  4.62,56.95 180 top
C4  41.66,59.33 90 top
C5  43.08,32.92 270 top
C6  79.45,39.22 270 top
C7  81.69,52.93 270 top
C8  83.72,18.29 180 top
C9  81.28,39.62 270 top
C10  82.91,39.62 270 top
C11  57.51,31.09 270 top
C12  55.68,30.89 270 top
C13  54.05,30.89 270 top
C14  83.72,16.87 180 top
C15  84.53,21.34 270 top
C16  82.91,21.34 270 top
C17  85.75,24.59 180 top
C18  85.75,26.21 180 top
C19  43.69,21.54 270 top
C20  42.27,21.54 270 top
C21  45.11,18.49 180 top
C22  45.11,17.07 180 top
C23  45.11,27.84 180 top
C24  45.11,26.21 180 top
C25  34.54,17.27 90 top
C26  4.62,62.03 180 top
C27  4.37,47.6 180 top
C28  47.75,59.13 0 top
C29  29.46,17.27 270 top
C30  26.82,18.08 90 top
C31  21.34,18.08 270 top
C32  25.15,32.77 270 top
C33  22.3,32.77 90 top
C34  29.97,55.83 270 top
C35  3.51,24.23 180 top
C36  58.12,48.97 90 top
C37  61.37,52.63 0 top
C38  65.23,45.72 180 top
C39  50.19,55.68 180 top
C40  38,32.92 270 top
C41  86.77,52.93 90 top
C42  92.86,17.88 180 top
C43  34.04,80.77 90 top
C44  43.69,80.77 90 top
C45  52.32,80.77 90 top
C46  61.47,80.77 90 top
C47  13.16,39.88 180 top
C48  12.85,33.02 90 top
C49  22.3,59.28 270 top
C50  71.63,80.77 90 top
C51  80.77,80.77 90 top
C52  45.11,51.82 180 top
C53  45.11,53.44 180 top
C54  50.6,42.47 0 bottom
C55  49.58,38.81 180 top
C56  56.29,48.97 270 top
C57  64.01,54.05 90 top
C58  39.42,50.6 270 top
C59  54.86,48.97 90 top
C60  44.7,46.13 180 top
IC1  68.58,35.05 180 top
IC2  17.88,62.18 270 top
IC3  21.34,45.21 270 top
IC4  20.83,22.86 270 top
IC5  4.88,59.54 270 top
IC6  4.67,45.11 270 top
IC7  3.66,21.54 270 top
IC8  44.3,59.33 0 top
IC9  56.9,80.77 0 top
IC10  40.64,32.92 0 top
IC11  38.61,80.77 0 top
IC12  16.76,33.27 180 top
IC13  84.12,53.04 180 top
IC14  26.01,59.39 180 top
IC15  76.2,80.77 0 top
IC16  32.11,17.27 0 top
IC17  24.18,17.27 0 top
IC18  10.11,65.23 180 top
IC19  10.06,49.68 180 top
IC20  10.31,27.43 180 top
IC21  51.41,49.17 0 top
IC22  90.32,23.01 270 top
IC23  44.5,48.97 90 top
IC24  50.09,23.57 270 top
J1  31.5,7.11 180 top
JP1  66.45,50.39 270 top
JP2  19.81,74.68 0 top
JP3  52.02,31.5 90 top
JP4  73.71,54.61 0 top
JP5  19.81,80.87 180 top
JP6  19.81,71.63 180 top
JP7  32.87,59.64 90 top
JP8  19.86,77.83 180 top
JP9  60.55,49.17 90 top
JP10  63.4,49.17 270 top
JP11  54.05,39.62 0 top
JP12  54.05,36.98 0 top
JP13  83.16,31.95 180 top
JP14  83.16,29.21 180 top
JP15  30.23,35.56 0 top
JP16  30.28,32 0 top
JP17  3.81,80.26 270 top
JP18  49.17,30.89 90 top
JP20  19.81,83.92 180 top
JP21  39.93,36.78 0 top
JP22  85.55,48.36 0 top
JP23  19.81,68.58 180 top
JP24  93.68,24.59 90 top
JP25  38,24.38 0 top
R1  78.03,64.47 180 top
R2  69.8,64.57 180 top
R3  83.87,13.46 180 top
R4  12.04,56.08 270 top
R5  5.64,35.76 270 top
R6  11.73,15.85 270 top
R7  49.68,15.09 180 top
R8  92.86,16.26 0 top
R9  14.99,3.86 270 top
R10  20.83,28.8 180 top
R11  22.56,36.42 180 top
R12  30.02,60.05 90 top
R14  66.55,14.33 180 top
R15  66.55,15.85 0 top
R16  71.12,14.33 0 top
R17  71.12,15.85 180 top
R18  71.12,22.96 0 top
R19  71.12,21.44 180 top
R20  75.69,14.33 0 top
R21  75.69,15.85 180 top
R22  75.69,22.96 0 top
R23  75.69,21.44 180 top
R24  80.06,14.33 0 top
R25  80.06,15.85 180 top
R26  75.59,23.37 180 bottom
R27  75.59,21.74 0 bottom
R28  75.59,13.21 180 bottom
R29  75.59,14.83 0 bottom
R30  70.92,23.37 180 bottom
R31  70.92,21.74 0 bottom
R32  57.4,14.73 180 top
R33  57.4,16.26 0 top
R34  66.55,22.96 180 top
R35  66.55,21.44 0 top
R36  61.98,14.33 180 top
R37  61.98,15.85 0 top
R38  61.98,22.96 180 top
R39  61.98,21.44 0 top
R40  79.86,23.37 180 bottom
R41  79.86,21.74 0 bottom
R42  80.06,13.21 180 bottom
R43  80.06,14.83 0 bottom
TP1  28.14,81.69 0 top
TP2  13.21,84.12 0 top
TP3  28.14,77.42 0 top
TP4  13.41,79.6 0 top
TP5  46.23,77.22 0 top
TP6  65.02,77.22 0 top
TP7  87.38,57.51 0 top
TP8  40.84,39.83 0 top
TP9  86.16,34.95 0 top
TP10  85.95,37.8 0 top
TP11  23.37,38.86 0 top
TP12  35.56,39.88 0 top
TP13  24.49,27.18 0 top
TP14  29.26,27.89 0 top
TP15  36.98,55.07 0 top
TP16  38.81,16.66 0 top
TP17  26.21,22.56 0 top
TP18  13.21,75.03 0 top
TP19  28.14,73.1 0 top
TP22  81.08,42.88 0 top
TP23  38.4,28.45 0 top
TP24  17.07,58.98 0 top
TP25  16.76,42.42 0 top
TP26  15.95,21.29 0 top
TP27  76.61,58.22 0 top
TP28  70.51,58.32 0 top
TP29  28.14,68.94 0 top
TP30  29.06,65.48 0 top
TP31  46.33,64.62 0 top
TP32  38.61,19.71 0 top
TP33  93.68,29.87 0 top
TP34  4.37,53.9 0 top
TP35  4.37,29.01 0 top
TP36  3.56,14.99 0 top
TP37  36.98,59.69 0 top
TP38  41.86,43.48 0 top
TP39  13.21,70.46 0 top
TP40  14.83,65.74 0 top
TP41  10.26,61.42 0 top
TP42  10.16,45.87 0 top
TP43  9.96,23.62 0 top
TP44  28.14,85.95 0 top
TP45  83.31,77.22 0 top
TP46  16.76,46.13 0 top
TP47  15.75,25.3 0 top
U$1  98.3,70.87 90 top

### Tracks (layer width: path | path; a pad name or v marks a point on that pad's centre or on a via)
!CS_ADC1
  Top 0.254: IC22.P$9 89.22,17.09 85.95,13.82 85.95,9.17 J1.A44
!CS_ADC2
  Top 0.254: IC24.P$9 51.82,16.79 54.36,14.25 J1.A19
!CS_DAC  (via drill 0.6)
  Top 0.254: IC23.9 41.56,48.47 40.84,47.75 v40.84,46.53
  Bottom 0.254: v40.84,46.53 41.66,46.53 42.88,45.31 42.88,19.91 48.16,14.63 48.16,9.17 J1.A14
ADC1_IN+
  Top 0.254: 90.27,22.2 IC22.P$12 90.27,26.52 88.85,27.94 84.99,27.94 83.72,29.21 JP14.2
ADC1_IN-
  Top 0.254: JP13.2 81.94,30.73 81.94,28.19 82.75,27.38 88.34,27.38 89.2,26.52 89.2,22.98 IC22.P$1
ADC2_IN+
  Top 0.254: JP3.2 52.02,31.34 50.29,29.62 48.41,29.62 47.9,29.11 47.9,26.31 50.04,24.18 IC24.P$12
ADC2_IN-
  Top 0.254: 48.97,23.54 IC24.P$1 49.07,23.61 49.07,24.33 47.45,25.96 47.45,30.28 48.06,30.89 JP18.2
AGND  (via drill 0.6)
  Top 0.254: C10.2 C9.2 80.77,38.27 C6.2 79.45,38 77.7,36.25 IC1.P$58
  Top 0.406: 82.94,38.81 C10.2 | IC1.P$58 75.51,36.25 74.98,36.78 74.98,40.23 75.79,41.05 IC1.P$64 78.39,42.67 80.87,42.67 TP22.TP 81.89,43.69
  Top 0.508: JP6.2 18.54,72.14 JP2.2 26.57,74.68 TP19.TP
  Top 0.61: R2.3 65.93,67.17 v64.82,68.28 | IC1.P$32 IC1.P$33 | IC1.P$48 76.08,28.37 | 76.08,28.37 IC1.P$49 | IC1.P$58 75.47,36.25 74.17,34.95 74.17,30.28 76.08,28.37
  Bottom 0.61: JP2.2 33.02,74.68 36.37,71.32 63.4,71.32 64.82,69.9 v64.82,68.28 | v82.91,56.29 82.91,58.93 77.06,64.77 68.43,64.77 64.87,68.33
  other vias: 52.63,23.77 54.66,23.16 58.32,40.84 58.52,45.11 73.15,39.01 77.42,43.89 73.56,45.92 76,73.15 83.92,67.26 86.97,60.55 90.63,51.41 69.7,68.68 34.75,70.92 38.61,72.54 56.08,73.56 79.45,51.61 45.92,73.15 86.77,40.84 86.97,45.31 94.89,37.39 85.55,71.53 94.28,54.66 58.52,38.81 50.39,36.58 72.34,49.58 76.81,48.36
  pour Route2 (isolate 0.254): 99.77,71.73 96.72,74.78 34.14,74.78 31.9,77.01 22.96,77.01 21.54,75.59 21.54,74.17 23.37,72.34 31.5,72.34 33.93,69.9 61.57,69.9 66.04,65.43 66.04,56.9 68.07,54.86 68.07,48.36 66.65,46.94 58.12,46.94 46.74,35.56 46.74,24.59 50.8,20.52 53.04,20.52 61.57,29.06 61.57,41.66 63.6,43.69 68.68,43.69 70.1,42.27 70.1,36.58 80.06,26.42 86.36,26.42 88.6,24.18 88.6,21.95 89.41,21.13 94.08,21.13 99.77,26.82
  pour Top (isolate 0.254): 96.72,74.78 34.14,74.78 31.9,77.01 22.96,77.01 21.54,75.59 21.54,74.17 23.37,72.34 31.5,72.34 33.93,69.9 61.57,69.9 66.04,65.43 66.04,56.9 68.07,54.86 68.07,48.36 66.65,46.94 58.12,46.94 46.74,35.56 46.74,24.59 50.8,20.52 53.04,20.52 61.57,29.06 61.57,41.66 63.6,43.69 68.68,43.69 70.1,42.27 70.1,36.37 80.06,26.42 86.36,26.42 88.6,24.18 88.6,21.95 89.41,21.13 94.08,21.13 99.77,26.82 99.77,71.73
  pour Bottom (isolate 0.254): 23.42,72.34 31.5,72.34 33.93,69.9 61.57,69.9 66.04,65.43 66.04,56.9 68.07,54.86 68.07,48.36 66.65,46.94 58.12,46.94 46.74,35.56 46.74,24.59 50.8,20.52 52.98,20.52 53.04,20.57 53.09,20.57 61.57,29.06 61.57,41.66 63.6,43.69 68.68,43.69 70.1,42.27 70.1,36.37 80.06,26.42 86.36,26.42 88.54,24.23 88.6,24.18 88.6,21.95 89.41,21.13 94.08,21.13 99.77,26.82 99.77,71.73 96.72,74.78 34.14,74.78 33.38,75.54 31.9,77.01 22.96,77.01 21.54,75.59 21.54,74.17 23.37,72.34
AVDD
  Top 0.406: 86.83,52.02 87.38,52.02 87.78,52.43 87.78,54.86 87.38,55.27 87.38,56.9 | 86.83,52.02 C41.1 86.82,52.03 JP22.2 | TP7.TP 87.38,56.9 | R1.1 80.53,63.74 87.38,56.9 | 86.83,52.02 85.36,52.02 IC13.5
AVDD_BEAN
  Top 0.254: C6.1 79.76,40.47 C9.1 C10.1 78.88,40.47 77.83,39.42 76.8,39.42 IC1.P$62
  Top 0.406: 83.07,40.64 C10.1
  Top 0.61: JP22.1 84.28,41.85 C10.1
BASELINE
  Top 0.254: IC1.P$56 79.97,34.65 82.91,37.59 85.75,37.59 TP10.TP
CAP_PRECHAR
  Top 0.254: IC1.P$14 64.18,45.52 C38.2
CAP_PRECHAR_1
  Top 0.254: JP1.1 64.28,52.93 C57.1 63.44,53.2 62.38,54.25 53.03,54.25 51.73,52.95 IC21.12
CLK  (via drill 0.6)
  Top 0.254: IC1.P$20 62.13,38.65 v62.99,37.8
  Bottom 0.254: R31.2 R30.1 69.09,23.37 64.01,28.45 64.01,36.78 v62.99,37.8
CLK_ADC1
  Top 0.254: IC22.P$10 90.27,17.32 87.38,14.43 J1.A45
CLK_ADC2
  Top 0.254: IC24.P$10 53.09,17.62 55.63,15.08 J1.A20
CLK_DAC  (via drill 0.6)
  Top 0.254: IC23.6 42.39,51.29 v42.06,51.61
  Bottom 0.254: v42.06,51.61 43.89,49.78 44.09,49.58 44.09,20.32 50.6,13.82 50.6,9.07 J1.A16
CLK_PRECH1  (via drill 0.6)
  Top 0.254: IC1.P$9 68.18,42.36 69.29,41.25 v69.29,39.42
  Bottom 0.254: R41.2 78.84,21.91 78.84,23.37 R40.1 79.01,26.45 78.74,26.72 69.29,36.17 v69.29,39.42
CLK_PRECH1_T
  Bottom 0.254: R40.2 81.48,23.37 82.09,22.76 82.09,10.49 J1.A42
CLK_PRECH2  (via drill 0.6)
  Top 0.254: IC1.P$10 67.38,41.53 v67.87,41.05
  Bottom 0.254: R42.1 R43.2 78.03,16.02 78.03,23.37 77.62,23.77 77.01,24.38 77.01,27.64 76.3,28.35 67.87,36.78 v67.87,41.05
CLK_PRECH2_T
  Bottom 0.254: J1.A40 81.03,13.09 R42.2
CLK_REF  (via drill 0.6)
  Top 0.254: IC20.4 8.1,28.47 v7.52,29.06 | v7.52,51.41 8.42,51.41 IC19.4 | IC18.4 8.92,66.27 v7.52,67.67
  Bottom 0.254: J1.A8 40.44,9.07 40.44,13.21 32.31,21.34 9.75,21.34 9.14,21.95 9.14,27.43 v7.52,29.06 7.11,29.06 6.5,29.67 6.5,51.82 | 6.5,51.82 6.5,66.65 v7.52,67.67 | v7.52,51.41 6.91,51.41 6.5,51.82
CLK_T
  Bottom 0.254: R30.2 72.54,23.37 73.15,22.76 73.15,15.04 72.14,14.02 J1.A33
CS_B0
  Top 0.254: IC1.P$41 68.98,24.68 68.68,24.38 68.48,24.18 68.48,17.34 67.4,16.26 R15.2 R14.1
CS_B0_T
  Top 0.254: 65.7,9.11 J1.A28 65.7,9.11 | R14.2 65.7,9.11
CS_B1
  Top 0.254: IC1.P$42 69.78,24.87 69.09,24.18 69.09,17.44 70.27,16.26 R17.2 R16.1
CS_B1_T
  Top 0.254: R16.2 71.97,13.04 70.71,11.79 68.33,9.4 J1.A30
CS_B2
  Top 0.254: IC1.P$43 70.51,26.8 70.51,25.4 70.27,25.16 R18.1 R19.2
CS_B2_T
  Top 0.254: R18.2 72.54,22.96 72.95,22.55 72.95,11.1 J1.A32
CS_B3
  Top 0.254: 73.76,22.35 73.76,21.95 | 73.76,21.95 73.76,17.34 73.76,16.93 R21.2 R20.1 | IC1.P$44 71.38,25.55 73.76,23.16 73.76,21.95
CS_B3_T
  Top 0.254: R20.2 76.5,14.33 73.97,11.79 73.97,9.58 J1.A34
CS_B4
  Top 0.254: IC1.P$45 72.18,25.62 R22.1 | R22.1 74.84,22.82 74.78,22.76 | R23.2 R22.1
CS_B4_T
  Top 0.254: J1.A36 76,9.07 76,11.18 77.83,13.01 77.83,21.74 77.22,22.35 76.61,22.96 R22.2
CS_B5
  Top 0.254: IC1.P$46 72.98,25.77 73.36,25.4 78.03,25.4 79.05,24.38 79.05,16.02 R25.2 R24.1
CS_B5_T
  Top 0.254: J1.A38 78.44,9.07 78.44,10.57 80.97,13.11 80.97,14.33 R24.2
CS_REF_1  (via drill 0.6)
  Top 0.254: IC18.6 9.81,64.36 8.74,65.43 v7.72,65.43
  Bottom 0.254: J1.A11 44.2,11.89 32.92,23.16 27.03,23.16 9.96,40.23 9.96,63.4 7.92,65.43 v7.72,65.43
CS_REF_2  (via drill 0.6)
  Top 0.254: IC19.6 9.76,48.97 9.14,49.58 v7.72,49.58
  Bottom 0.254: J1.A10 42.93,12.34 32.72,22.55 26.82,22.55 9.35,40.03 9.35,47.95 v7.72,49.58
CS_REF_3  (via drill 0.6)
  Top 0.254: IC20.6 10.01,26.77 9.55,27.23 v7.32,27.23
  Bottom 0.254: J1.A7 39.12,13.72 32.11,20.73 9.35,20.73 8.53,21.54 8.53,26.62 7.92,27.23 v7.32,27.23
DGND  (via drill 0.6)
  Top 0.254: C13.2 C12.2 57.4,30.04 C11.2 57.57,30.07 58.12,30.07 58.73,30.68 58.73,31.7 59.28,32.25 IC1.P$28 62.03,32.25 v62.59,31.7
  Top 0.406: C40.2 37.76,32.07
  Top 0.508: JP6.1 25.45,71.63 TP29.TP | 37.76,32.07 v36.37,30.68 | 41.25,29.87 v41.66,29.87 | C5.2 43.08,31.29 v41.66,29.87 | IC10.2 40.64,30.28 | 40.64,30.28 41.05,29.87 v41.66,29.87 | TP23.TP 38.41,30.68 | C40.2 38.41,31.66 38.41,30.68 | 38.41,30.68 38.81,30.28 40.64,30.28
  Route2 0.508: JP6.1 21.18,71.53 30.07,71.53 35.36,66.24 35.36,46.13 36.37,45.11 v36.37,30.68 | v62.59,31.7 64.01,30.28 64.01,28.65 52.43,17.07 47.14,17.07 41.66,22.55 v41.66,29.87
DIGIPOT1
  Top 0.406: IC18.1 14.3,66.27 TP40.TP 16.93,63.64 IC2.1
DIGIPOT2
  Top 0.406: IC19.1 13.08,50.72 13.82,49.99 16.76,47.04 TP46.TP 20.12,46.13 IC3.1
DIGIPOT3
  Top 0.406: IC20.1 11.34,28.45 11.99,28.45 15.14,25.3 TP47.TP 16.05,24.99 16.26,24.99 17.74,23.51 IC4.1
DVDD
  Top 0.406: C40.1 38.28,33.77 | 41.2,39.47 TP8.TP
  Top 0.508: TP8.TP 38.66,37.64 JP21.1 39.69,35.75 IC10.5 38.45,34.22 C40.1
DVDD_BEAN  (via drill 0.6)
  Top 0.254: C13.1 C12.1 57.2,31.74 C11.1 58.52,33.05 IC1.P$27 62.52,33.05 v62.59,33.12
  Route3 0.508: v62.59,33.12 62.18,33.53 54.25,33.53 52.43,35.36 43.28,35.36 41.86,36.78 JP21.2
GND  (via drill 0.6)
  Top 0.254: TP34.TP 4.37,55.68 3.86,56.19 3.86,56.84 C3.2 | C16.2 C15.2 | C14.2 C8.2 | C42.2 R8.1 90.79,15.04 v90.63,15.04 | C23.2 C24.2 | C22.2 C21.2 | 43.65,46.33 C60.2 | v42.27,18.69 39.62,18.69 TP32.TP | IC24.P$3 45.77,23.52 v45.31,23.98 | IC21.10 53,49.82 v53.44,49.38 | IC21.13 51.09,53.12 v53.44,55.47
  Top 0.406: IC19.3 9.76,50.19 10.16,49.78 10.57,49.78 11.06,49.29 IC19.8 | C2.2 4.46,15.89 TP36.TP | IC20.3 10.01,27.58 10.16,27.43 11.18,27.43 11.38,27.23 11.38,26.24 IC20.8 | 21.58,17.48 C31.2 | TP35.TP 4.37,31.93 R5.3 | 46.94,64.01 TP31.TP | IC24.P$6 43.71,20.67 C19.2 C20.2 | IC18.3 9.81,65.58 10.16,65.23 10.57,65.23 11.11,64.68 IC18.8 | IC4.2 14.22,22.86 v12.7,24.38 | IC23.3 45.36,48.97 44.68,49.65 44.68,51.4 C52.2
  Top 0.508: JP17.3 12.95,75.18 TP18.TP 18.19,75.03 JP2.1 | TP33.TP 92.46,31.09 v89.92,31.09 89.05,31.95 JP13.1 87.53,31.95 v88.49,32.92 | v83.11,26.01 84.7,26.01 C18.2 C17.2
  Bottom 0.406: C54.2 49.75,41.11 v49.28,40.64 | R31.1 71.77,19.34 v70.92,18.69 | R27.1 76.44,19.54 v75.59,18.69 76.44,17.84 R29.1 | R43.1 80.91,17.83 80.3,18.44 v79.96,18.44 | R41.1 80.71,19.98 v81.13,19.56
  Bottom 0.508: 87.78,31.95 89.05,31.95 | 89.05,31.95 v89.92,31.09 | JP13.1 87.78,31.95 | 89.05,31.95 95.25,31.95 97.54,29.67 97.54,21.13 98.15,20.52 98.35,20.73 | v88.49,32.92 88.49,32.66 87.78,31.95
  other vias: 56.49,18.08 61.98,18.69 66.45,18.69 33.73,29.26 48.77,57.1 55.07,46.33 56.49,52.83 61.77,55.47 38.81,45.72 6.91,17.17 1.52,26.31 19.41,25.6 21.34,15.75 27.94,15.95 1.52,31.5 8.74,30.89 2.13,41.05 12.7,47.75 21.34,41.45 23.67,30.63 8.64,55.88 2.03,56.39 12.7,63.7 41.76,61.67 34.04,83.82 53.34,83.31 72.14,83.82 33.53,77.72 65.23,80.87 87.38,77.72 65.13,56.39 49.07,61.26 41.96,84.02 70,76.91 58.12,80.47 49.58,68.38 61.37,63.7 86.36,86.66 7.52,87.88 62.38,87.27 1.63,62.08 1.63,68.17 19.41,55.17 32.46,53.49 23.88,53.34 13.92,44.3 1.52,47.55 26.31,48.46 29.57,39.52 17.68,11.79 32.11,14.02 19.3,4.78 30.02,44.86 36.47,68.38 85.85,23.16 1.73,43.08 6.1,19.41 28.14,18.19 35.97,13.41 23.67,13.31 43.38,56.39 81.48,26.01 98.25,20.73 96.62,19.3 99.26,21.54 28.6,59.08 31.75,51.31 23.67,32.87 1.12,24.08 27.74,12.7 14.02,6.2 15.14,62.89 48.87,81.99 79.25,85.45 83.52,82.4 37.02,49.65 45.12,48.06
  pour Route2 (isolate 0.254, rank 2, no thermals): 0,89.92 100.08,89.92 100.08,0 0,0
  pour Top (isolate 0.254, rank 2, no thermals): 0,89.92 100.08,89.92 100.08,0 0,0
  pour Bottom (isolate 0.406, rank 2): 0,0 100,0 100,90 0,90
HOLD
  Top 0.254: IC1.P$37 65.78,25.81 62.94,22.96 R38.1 R39.2
HOLD_T
  Top 0.254: J1.A25 61.98,10.97 59.74,13.21 59.74,21.74 60.96,22.96 R38.2
MUX_DAC_EN  (via drill 0.6)
  Top 0.254: IC21.15 49.82,53.28 v50.6,54.05
  Bottom 0.254: v50.6,54.05 50.6,49.78 48.56,47.75 48.16,47.35 47.75,46.94 47.35,46.53 47.35,27.23 52.22,22.35 56.49,22.35 58.17,20.68 J1.A22
MUX_DAC_SEL  (via drill 0.6)
  Top 0.254: IC21.1 49.17,46.41 48.04,46.41 45.92,44.3 v45.92,43.69
  Bottom 0.254: v45.92,43.69 45.92,42.88 46.74,42.06 46.74,27.03 52.02,21.74 56.29,21.74 57.51,20.52 57.51,12.39 56.9,11.79 J1.A21
MUX_REF_1  (via drill 0.6)
  Top 0.254: IC2.6 18.83,63.67 v18.09,64.41
  Bottom 0.254: J1.A12 45.47,11.43 33.12,23.77 27.23,23.77 17.88,33.12 17.88,64.21 v18.09,64.41
MUX_REF_2  (via drill 0.6)
  Top 0.254: IC3.6 22.29,46.4 v21.34,47.35
  Bottom 0.254: J1.A13 46.74,10.97 33.53,24.18 33.33,24.38 27.64,24.38 27.43,24.38 27.03,24.79 19.91,31.9 19.91,45.92 v21.34,47.35
MUX_REF_3  (via drill 0.6)
  Top 0.254: IC4.6 21.78,24.22 v22.55,24.99
  Bottom 0.254: J1.A9 41.66,12.8 32.72,21.74 32.51,21.95 24.59,21.95 23.37,23.16 22.55,23.98 v22.55,24.99
N$1
  Top 0.254: 60.5,50.39 JP9.2 | JP9.2 60.55,52.59 C37.1 | C36.2 59.93,49.82 JP9.2
N$2
  Top 0.406: J1.B1 31.5,3.05 30.48,2.03 15.96,2.03 R9.2
N$3
  Top 0.254: C37.2 62.22,51.63 JP10.1
N$4
  Top 0.254: J1.A46 J1.A48
N$5  (via drill 0.6)
  other vias: 3.86,8.74
N$6
  Top 0.254: JP1.2 65.63,50.39 65.02,49.78 65.02,46.77 C38.1
N$10
  Top 0.254: C42.1 R8.2 93.67,16.22 93.67,14.83 96.32,12.19 96.32,8.53 93.73,5.94 J1.B50
OP_MODE  (via drill 0.6)
  Top 0.254: IC1.P$11 66.58,41.59 66.04,41.05 v66.04,39.42
  Bottom 0.254: R27.2 R26.1 74.57,23.53 74.57,29.26 66.04,37.8 v66.04,39.42
OP_MODE_T
  Bottom 0.254: J1.A37 77.22,11.99 77.32,12.09 77.42,12.19 77.42,22.96 77.01,23.37 R26.2
OUT_S
  Top 0.254: 63.8,24.59 63.4,24.18 60.96,24.18 59.94,24.18 59.13,23.37 59.13,22.35 59.13,17.88 58.25,17 R33.2 R32.1 | 63.8,24.59 64.01,24.79 | IC1.P$35 64.18,24.96 63.8,24.59
OUT_S_T
  Top 0.254: J1.A24 60.71,9.8 56.9,13.61 56.9,14.39 R32.2
POT_R1
  Top 0.406: JP4.3 76.25,57.86 TP27.TP 78.03,59.64 R1.2 75.53,64.36 R1.3
POT_R2
  Top 0.406: R2.1 72.3,64.47 R2.2 70.51,61.26 TP28.TP 71.17,57.66 JP4.1
POT_R4
  Top 0.406: R4.2 14.64,56.55 TP24.TP 16.93,59.12 IC2.3
POT_R5
  Top 0.406: IC3.3 19.57,44.56 17.48,42.47 | 17.48,42.47 17.27,42.27 | 17.27,42.27 16.92,42.27 TP25.TP | R5.2 8.24,38.72 11.79,42.27 17.27,42.27 | 17.27,42.27 17.48,42.47
POT_R6
  Top 0.406: IC4.3 17.54,22.21 16.66,21.34 16,21.34 TP26.TP 15.95,19.09 14.34,17.48 R6.2
REF_ADC
  Top 0.406: C31.1 21.5,18.77 23.03,18.77 IC17.5 23.23,19.57 TP17.TP 28.04,24.38 JP25.1
  Route3 0.508: JP25.1 36.73,23.42 37.39,22.76 | 37.59,22.55 37.39,22.76 | 37.39,22.76 42.27,22.76 44.5,24.99 89,24.99 90.68,23.32 JP24.1
REFIN_DAC
  Top 0.406: 43.28,54.66 43.28,50.6 44.09,49.78 44.09,48.36 43.69,47.95 42.4,47.95 IC23.10 | 43.28,54.66 43.69,55.07 44.5,55.07 46.94,57.51 C28.1 46.9,61.4 46.13,62.18 44.3,62.18 43.28,61.16 43.28,60.7 IC8.5 | 43.28,54.66 42.67,54.66 41.86,55.47 37.39,55.47 TP15.TP
RES_BIAS_EXT
  Top 0.254: IC1.P$6 70.58,50.06 73.76,53.24 73.76,54.56 JP4.2
RST
  Top 0.254: IC1.P$38 66.58,25.33 66.45,25.2 64.01,22.76 64.01,18.49 62.83,17.31 R37.2 R36.1
RST_CSA  (via drill 0.6)
  Top 0.254: IC1.P$12 65.78,42.01 v64.82,41.05
  Bottom 0.254: R28.1 R29.2 73.76,15.81 73.76,29.26 73.56,29.46 73.15,29.87 64.82,38.2 v64.82,41.05
RST_CSA_T
  Bottom 0.254: R28.2 76.44,12.64 74.78,10.97 74.68,10.87 J1.A35
RST_T
  Top 0.254: J1.A26 63.2,9.07 63.2,11.18 61.13,13.24 R36.2
SDI_DAC  (via drill 0.6)
  Top 0.254: IC23.7 41.36,49.47 40.84,49.99 40.64,50.19 40.64,53.03 v40.84,53.24
  Bottom 0.254: J1.A15 49.38,7.21 49.38,14.22 43.48,20.12 43.48,49.38 42.06,49.38 40.64,50.8 40.64,53.03 v40.84,53.24
SDI_REF  (via drill 0.6)
  Top 0.254: IC20.5 7.07,26.17 v6.71,25.81 | IC19.5 7.38,48.42 5.22,48.42 v4.47,49.17 | v5.28,64.01 9.12,64.01 IC18.5
  Bottom 0.254: 5.89,48.56 5.89,47.55 5.89,24.99 | 5.89,24.99 5.89,22.76 8.53,20.12 31.9,20.12 38,14.02 38,9.17 J1.A6 | v6.71,25.81 5.89,24.99 | v4.47,49.17 5.28,49.17 5.89,48.56 | 5.89,48.56 5.89,63.4 v5.28,64.01
SDO_ADC1
  Top 0.254: 84.84,13.51 85.14,13.82 87.88,16.56 88.32,17 IC22.P$8 | 84.84,13.51 84.77,13.51 R3.1 | 84.84,13.51 J1.A43
SDO_ADC2
  Top 0.254: IC24.P$8 48.16,19.55 48.16,18.49 50.55,16.1 50.55,15.1 R7.1 53.09,12.53 J1.A18
SGN
  Top 0.254: IC1.P$39 67.38,22.98 R34.1 R35.2
SGN_T
  Top 0.254: J1.A27 64.52,21.23 64.52,22.45 65.02,22.96 R34.2
V0NDAC
  Top 0.254: IC23.2 50.89,48.47 51.21,48.16 | 51.21,48.16 51.82,47.55 51.82,46.51 IC21.5 | C59.1 51.24,48.12 51.21,48.16
V0PDAC
  Top 0.254: IC21.2 49.78,46.46 49.78,47.35 49.16,47.97 IC23.1 45.55,46.91 C60.1
V1NDAC
  Top 0.254: 50.19,50.19 49.97,49.97 IC23.5 46.94,50.3 46.94,52.43 45.96,53.4 C53.1 | 50.19,50.19 50.39,50.39 | IC21.14 50.46,50.46 50.19,50.19
V1PDAC
  Top 0.254: IC21.11 52.43,51.86 52.43,50.19 51.71,49.47 IC23.4 45.63,49.47 45.31,49.78 45.31,51.17 C52.1
V_REF_PRECHAR  (via drill 0.6)
  Top 0.254: JP7.2 36.93,59.64 TP37.TP
  Top 0.406: IC1.P$7 69.78,44.62 v69.09,45.31
  Bottom 0.406: v69.09,45.31 69.09,55.47 65.02,59.54 33.63,59.54 33.53,59.64 JP7.2
V_REF_PRECHAR_BUFF
  Top 0.254: IC14.2 IC14.1 29,60.9 R12.2
V_REF_PRECHAR_BUFF_FIL
  Top 0.254: JP7.1 30.77,59.2 R12.1 29.97,59.15 C34.1
VDD  (via drill 0.6)
  Top 0.254: IC23.8 41.01,48.97 40.23,49.75 C58.2
  Top 0.406: IC4.5 21.23,22.86 20.93,23.16 v20.93,24.79 | IC3.5 24.08,45.21 v24.18,45.31 | v20.73,62.99 19.91,62.18 IC2.5 | v47.35,55.27 48.93,55.27 C39.2 49.19,55.52 IC21.16 | v38.81,48.16 38.81,49.14 C58.2
  Top 0.508: C44.1 43.04,79.92 | v1.52,59.44 2.37,58.59 IC5.3 3.64,58.52 4.67,58.52 | IC18.2 10.46,67.77 v10.16,68.07 | v11.99,52.12 10.67,52.12 10.41,51.86 IC19.2 | IC20.2 10.66,29.97 v11.18,30.48 | 4.67,58.52 5.27,57.92 C3.1 | IC5.1 4.74,60.49 4.88,60.35 4.88,58.73 4.67,58.52 | IC6.1 4.33,46.06 4.67,45.72 4.67,44.09 | 4.67,44.09 4.67,43.75 | 4.67,43.75 4.18,43.26 C1.1 | v7.62,43.18 5.25,43.18 4.67,43.75 | IC6.3 4.61,44.16 4.67,44.09 | C2.1 2.03,19.05 | IC7.1 2.42,22.55 3.45,22.55 3.66,22.35 3.66,20.93 3.32,20.59 IC7.3 2.36,19.38 2.03,19.05 | v1.83,19.1 1.98,19.1 2.03,19.05
  other vias: 42.67,76.71 42.67,78.23 46.23,79.25 47.75,79.25
  pour Route3 (isolate 0.254, no thermals): 0,89.92 100.08,89.92 100.08,0 0,0
  pour Top: 39.62,80.26 39.62,75.69 48.77,75.69 48.77,80.26
VDD2  (via drill 0.6)
  Top 0.406: C7.1 82.63,53.58 82.84,53.37 | C5.1 43.65,33.57 | IC13.1 85.08,53.58 84.53,53.03 83.17,53.03 82.84,53.37 | IC13.3 83.17,53.71 82.84,53.37
  Top 0.508: IC9.3 59.22,77.67 60.37,78.82 | 60.37,78.82 C46.1 | C7.1 81.69,54.66 v81.28,55.07 | TP6.TP v61.47,77.22 60.37,78.31 60.37,78.82 | v45.31,37.39 45.31,35.23 43.65,33.57 | IC10.1 39.69,32.38 40.03,32.72 41.25,32.72 41.59,32.38 | IC10.3 41.59,32.38 | 41.59,32.38 41.59,32.65 42.47,33.53 43.04,33.53 C5.1
  Route3 0.508: 66.04,70.1 77.62,70.1 81.28,66.45 v81.28,55.07 81.48,54.86 81.48,49.78 73.76,42.06 48.36,42.06 45.31,39.01 v45.31,37.39
  Route3 0.61: 66.04,70.1 61.37,74.78 61.37,77.11 v61.47,77.22
VDD3  (via drill 0.6)
  Top 0.254: C16.1 C15.1 84.6,21.91 IC22.P$4 | 43.81,22.47 C19.1
  Top 0.406: 43.81,22.47 IC24.P$4 | C19.1 C20.1 42.27,22.15 | IC17.3 25.36,15.97 C30.1 | IC17.3 25.13,14.56 | IC17.1 23.23,16.73 23.57,17.07 24.79,17.07 24.99,16.87 24.99,16.11 IC17.3 | 34.16,16.24 33.89,15.97 IC16.3 33.06,16.93 32.72,17.27 31.5,17.27 31.16,16.93 IC16.1 | 34.16,16.24 C25.1 | v34.54,15.04 34.54,15.85 34.16,16.24
  Top 0.508: IC15.3 78.52,77.67 | TP45.TP 81.79,77.22 | IC12.8 19.3,30.67 21.13,32.51 v21.13,34.75 | C16.1 82.91,23.77 v83.11,23.98 | IC14.8 27.84,56.71 v27.84,53.85 | 25.13,14.56 v24.99,14.43 | C20.1 41.62,21.74 40.23,21.74 v40.03,21.54 | IC8.1 43.35,58.24 42.9,58.68 43.55,59.33 44.91,59.33 45.25,58.99 IC8.3
  Top 0.61: 42.9,58.68 C4.1 40.48,57.51 v40.44,57.51
  Route3 0.406: v40.44,57.51 36.58,57.51 34.14,55.07 29.06,55.07 v27.84,53.85
  Route3 0.508: v27.84,53.85 25.5,51.51 22.25,51.51 18.09,47.35 18.09,35.56 | v21.13,34.75 18.9,34.75 18.09,35.56 | 81.48,75.79 86.77,75.79 98.15,64.41 98.15,22.96 93.47,18.29 84.73,18.29 81.08,21.95 | 81.48,75.79 80.57,75.79 v80.26,76.1 | 81.08,21.95 40.64,21.95 40.23,21.54 v40.03,21.54 40.03,20.52 v34.54,15.04 25.6,15.04 v24.99,14.43 20.32,14.43 18.09,16.66 18.09,35.56 | 81.08,21.95 v83.11,23.98 | 80.26,77.62 80.26,77.01 81.48,75.79
  other vias: 80.26,77.52
  pour Top: 77.42,80.47 77.42,75.59 82.3,75.59 82.3,76 82.3,80.47
VDD_REF_1
  Top 0.406: R4.1 9.44,60.59 TP41.TP | 9.55,61.47 9.75,61.47 | 9.75,61.47 10.21,61.47 TP41.TP | IC18.7 10.46,62.17 9.75,61.47 | TP41.TP 9.33,60.49 IC5.5 5.47,61.19 C26.1
VDD_REF_2
  Top 0.406: 9.97,46.06 TP42.TP | TP42.TP 10.16,47.35 10.41,47.59 IC19.7 | TP42.TP 9.58,45.29 9.34,45.05 9.34,42.87 4.88,38.41 3.18,38.41 R5.1
  Top 0.508: C27.1 5.97,46.84 IC6.5 8.8,46.06 9.58,45.29
VDD_REF_3
  Top 0.406: TP43.TP 9.14,23.77 | TP43.TP 10.11,23.62 10.36,23.37 10.21,23.37 | 10.21,23.37 TP43.TP | IC20.7 10.66,24.33 TP43.TP | 10.21,23.37 10.21,19.43 R6.1
  Top 0.508: IC7.5 4.96,22.64 5.94,23.62 6.1,23.62 | 6.1,23.62 TP43.TP | C35.1 5.49,24.23 6.1,23.62
VDD_SUPPLY_1
  Top 0.508: IC11.1 36.07,77.78 36.07,79.25 35.39,79.92 C43.1 33.87,79.76 33.02,79.76 31.09,81.69 TP1.TP 21.89,81.69 JP5.1
VDD_SUPPLY_2
  Top 0.508: C45.1 52.32,78.74 52.93,78.13 | 27.43,77.72 TP3.TP | IC9.1 53.39,77.67 52.93,78.13 | JP8.1 25.81,77.83 26.21,77.42 TP3.TP | TP3.TP 30.89,74.68 49.48,74.68 52.93,78.13
VDD_SUPPLY_3
  Top 0.508: 71.46,79.76 C50.1 | C50.1 71.63,79.81 IC15.1 | JP20.1 26.11,83.92 TP44.TP 64.01,85.95 70.1,79.86 71.56,79.86 C50.1
VDD_SUPPLY_IN_1
  Top 0.508: JP17.1 8.13,80.26 11.99,84.12 TP2.TP | TP2.TP 13.41,84.33 13.82,84.33 15.75,84.33 18.14,84.33 JP20.2 | JP5.2 16.46,80.87 TP2.TP
VDD_SUPPLY_IN_2
  Top 0.508: JP17.2 12.14,77.72 13.41,78.99 TP4.TP 14.02,78.84 14.02,78.79 | JP8.2 14.99,77.83 14.1,78.72 14.02,78.79 | 13.82,78.99 14.02,78.79
VI+_FIL
  Top 0.254: JP11.2 55.88,39.62 58.52,36.98 60.33,36.98 IC1.P$22
VI+_FIL_DAC  (via drill 0.6)
  Top 0.254: IC21.4 51.09,44.7 50.69,44.3 v50.6,44.3
  Bottom 0.254: v50.6,44.3 51.45,43.45 C54.1 52.78,41.13 JP11.1
VI-_FIL
  Top 0.254: JP12.2 57.71,36.98 58.12,36.58 58.44,36.25 IC1.P$23
VI-_FIL_DAC
  Top 0.254: JP12.1 52.02,36.98 51.21,37.8 50.43,38.57 C55.1 50.6,38.98 50.6,40.64 52.02,42.06 53,43.04 53,45.07 IC21.7
VICM  (via drill 0.6)
  Top 0.254: IC21.3 50.39,46.36 50.39,45.52 v48.77,43.89 49.99,42.67 51.21,42.67 52.02,43.48 v52.02,44.3 52.36,44.64 IC21.6 | IC1.P$40 68.18,28.76 v68.28,28.85
  Top 0.406: JP15.2 30.23,34.59 30.89,33.93 34.34,33.93 35.76,35.36 35.76,39.83 | v48.77,43.89 46.53,41.66 37.59,41.66 35.76,39.83 | TP12.TP 35.71,39.88 35.76,39.83
  Bottom 0.254: v68.28,28.85 68.28,33.73 62.59,39.42 62.59,42.47 61.16,43.89 54.66,43.89 54.25,44.3 v52.02,44.3
VICM_BUFF
  Top 0.254: IC12.2 IC12.1 19.22,36.42 R11.2
VICM_BUFF_FIL
  Top 0.254: R11.1 23.41,35.36 24,34.77 | 24,34.77 C32.1 | JP15.1 24.79,35.56 24,34.77
VICM_MUX
  Top 0.254: IC12.3 16.13,37.76
  Top 0.406: TP11.TP 23.37,43.48 IC3.4 | IC12.3 16.13,38.08 16.66,38.61 23.11,38.61 TP11.TP | 16.13,37.76 C47.1 | JP15.3 32.77,36.32 32.11,36.98 25.25,36.98 TP11.TP
VIN_CSA
  Top 0.254: IC1.P$15 63.38,47.89 JP10.2
  Bottom 0.254: JP1.3 63.45,47.85 JP10.2
VIN_CSA_1
  Top 0.254: IC21.9 55.68,51.92 56.29,51.31 C56.1 56.29,49.78 57.51,48.56 57.67,48.56 C36.1 58.12,47.75 60.4,47.75 | 60.4,47.75 JP9.1 60.4,47.75
VL_ADC  (via drill 0.6)
  Top 0.254: C14.1 C8.1 | IC22.P$7 87.17,19.06 | C22.1 C21.1 46.06,18.49 IC24.P$7 | C29.1 29.46,18.09 | TP16.TP 37.8,16.66
  Top 0.406: 84.36,15.68 v83.92,15.24 83.02,14.34 R3.2 | C22.1 45.92,17.03 45.92,16.66 45.11,15.85 | TP16.TP 42.47,16.66 43.28,15.85 44.91,15.85 | R7.2 48.07,15.85 45.11,15.85 | 44.91,15.85 45.11,15.85 | v45.92,14.02 45.92,14.83 44.91,15.85 | 87.17,19.06 85.34,19.06 C8.1 | C29.1 29.91,18.57 IC16.5 31.09,18.64 31.09,19.51 31.7,20.12 34.34,20.12 37.8,16.66
  Top 0.508: 84.36,15.68 84.36,16.66 C14.1
  Route3 0.406: v83.92,15.24 46.74,15.24 45.92,14.43 v45.92,14.02
VO+_BP_FIL
  Top 0.254: IC1.P$24 53.44,35.45 JP3.3
VO+_CH
  Top 0.254: IC1.P$50 79.98,29.85 JP14.3
VO+_FIL
  Top 0.254: IC1.P$30 59.46,30.65 58.98,30.18 58.98,29.46 58.47,28.96 JP3.1
VO-_BP_FIL
  Top 0.254: IC1.P$25 54.57,34.65 52.68,32.77 50.44,32.77 49.78,33.43 JP18.3
VO-_CH
  Top 0.254: IC1.P$52 76.81,31.5 80.16,31.5 JP13.3
VO-_FIL  (via drill 0.6)
  Top 0.254: v62.59,29.87 62.57,29.85 IC1.P$31 59.57,29.85 59.38,29.67 59.38,28.7 58.17,27.48 49.99,27.48 49.73,27.74 49.73,27.79 JP18.1
VOCM  (via drill 0.6)
  Top 0.254: IC1.P$36 64.98,28.81 v65.23,29.06 64.01,29.06 63.38,28.43 IC1.P$34
  Top 0.508: TP14.TP 29.82,27.89 v31.9,25.81
  Route3 0.254: v65.23,29.06 61.98,29.06 59.33,26.42 33.73,26.42 32.51,27.64 | 32.51,27.64 30.28,29.87 JP16.2 | v31.9,25.81 31.9,27.03 32.51,27.64
VOCM_1
  Top 0.254: IC2.4 20.91,61.53 C49.1 25.08,60.13 25.4,60.45 25.4,61.96 IC14.3 25.38,63.07 26.21,63.91 27.84,65.53 29.01,65.53 TP30.TP 29.41,65.13 31.29,65.13 32.87,63.55 JP7.3
VOCM_BUFF
  Top 0.254: IC12.6 IC12.7 17.4,29.34 17.93,28.8 R10.2
VOCM_BUFF_FIL
  Top 0.254: C33.1 22.3,31.71 21.68,31.09 R10.1 22.29,29.41 25.09,29.41 27.69,32 JP16.1
VOCM_MUX
  Top 0.254: C48.1 14.35,30.67 IC12.5 14.83,30.65 14.83,29.46 17.12,27.18 TP13.TP 24.94,27.18 27.84,30.07 31.5,30.07 32.82,31.39 | IC4.4 21.84,22.15 22.35,22.15 22.86,22.66 23.98,23.77 23.98,27.18 24,27.19
  Top 0.406: JP16.3 32.82,31.39 | 22.91,27.23 24,27.19 TP13.TP
VOUT_CSA
  Top 0.254: IC1.P$54 77.96,33.05 78.89,33.98 83.11,33.98 83.95,33.15 | JP14.1 85.7,29.82 84.43,31.09 84.43,32.66 83.95,33.15 | TP9.TP 85.75,34.95 83.95,33.15
VREF_ADC1  (via drill 0.6)
  Top 0.406: C17.1 C18.1 88.04,26.21 v88.09,26.16
  Top 0.508: IC22.P$2 88.32,23.84 87.58,24.59 C17.1
  Route3 0.508: JP24.2 88.39,25.86 v88.09,26.16
VREF_ADC2
  Top 0.406: C24.1 45.96,26.05 46.29,26.05 47.24,25.09 | C24.1 C23.1 | C24.1 46.13,26.21 | IC24.P$2 48.09,24.25 47.24,25.09 | JP25.2 39.83,24.38 40.44,24.99 47.14,24.99 47.24,25.09
VSS  (via drill 0.6)
  Top 0.508: IC14.4 24.11,64.01 | 24.11,64.01 24.11,65.56 JP23.1 | IC12.4 11.69,35.87 v11.58,35.76 | v22.35,64.62 23.5,64.62 24.11,64.01
  Route3 0.508: v22.35,64.62 22.35,55.68 22.35,55.47 11.79,44.91 11.79,44.7 11.79,44.3 11.79,35.97 v11.58,35.76
VSS_IN
  Top 0.508: JP23.2 16.66,68.58 14.78,70.46 TP39.TP 5.99,70.46 JP17.4

### Text on the board
tPlace: VDD | VDD2 | 5V | WAC | IC-UC | v10-2015
tNames: TP44 | TP2 | JP20 | TP1 | JP5 | C44 | C46 | C51 | TP4 | VDD1 | C43 | C50 | JP8 | TP3 | C45 | VDD2 | TP18 | JP2 | TP5 | TP6 | TP45 | GND | TP19 | JP6 | VSS | TP39 | JP17 | TP29 | JP23 | IC18 | TP40 | TP31 | TP30 | C26 | R12 | IC8 | TP41 | IC2 | TP27 | IC5 | IC14 | C28 | C3 | TP24 | TP37 | C4 | TP7 | C49 | C39 | TP28 | C57 | AVDD | JP7 | JP1 | JP4 | C34 | C37 | C41 | TP15 | C53 | TP34 | C7 | C59 | C36 | C58 | IC13 | JP22 | C27 | IC19 | TP46 | C60 | C56 | JP9 | JP10 | TP22 | AGND | IC6 | TP42 | IC3 | TP38 | TP12 | C1 | TP25 | JP11 | TP11 | DVDD | C47 | TP8 | JP21 | C55 | JP12 | C9 | C10 | JP15 | C6 | IC1 | R11 | C32 | IC12 | The Bean 2 | JP16 | C5 | JP14 | C48 | C40 | TP33 | C33 | IC10 | JP13 | IC20 | C13 | C12 | C11 | R10 | C23 | TP35 | TP47 | DGND | TP23 | C24 | C18 | TP13 | TP14 | JP18 | JP3 | JP24 | C35 | R38 | R34 | R18 | R22 | C17 | IC7 | JP25 | C20 | C19 | TP43 | C15 | IC4 | TP17 | TP32 | C16 | IC22 | TP26 | IC24 | R39 | R35 | R19 | R23 | C25 | C42 | C2 | C21 | C31 | C22 | R33 | R37 | R15 | R17 | R21 | R25 | C8 | C30 | C14 | C29 | TP16 | R7 | R8 | R32 | TP36 | IC17 | IC16 | R36 | R14 | R16 | R20 | R25 | JP3 | R9
bNames: C54 | R30 | R26 | R40 | R31 | R27 | R41 | R29 | R43 | R42 | R28